# EAGLE schematic PLC.63001-Silo-Medium (EAGLE 9.6.2)

## Sheet 1 of 11: Main Connectors
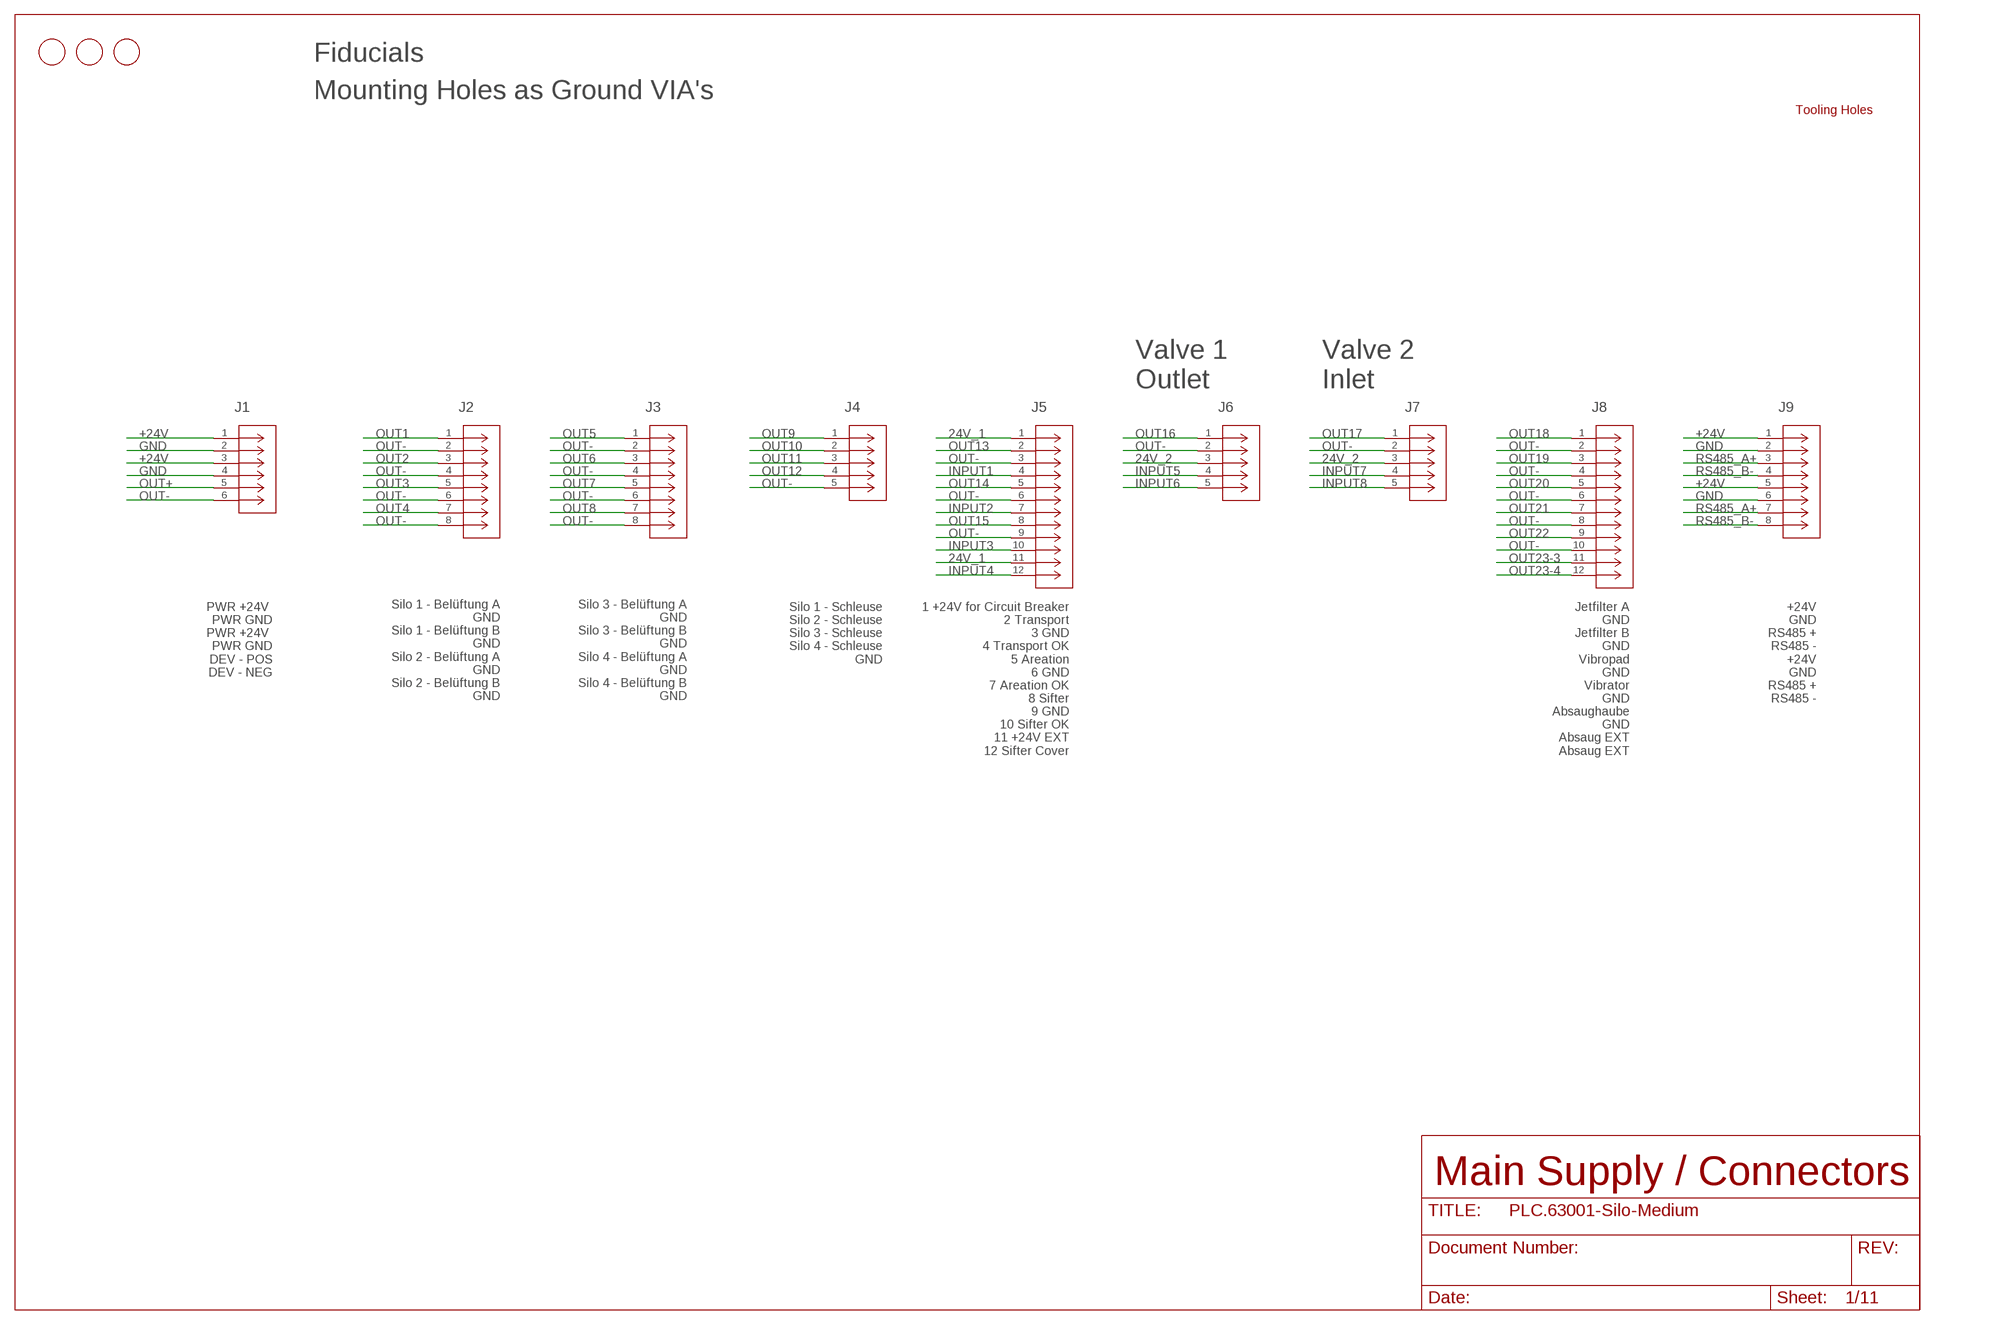
[diagram p0: schematic, sheet 1]

### Parts
J1  OMN_5_06  [CONN6_8000072438_WED]
J2  OMN_5_08  OMN_5_08ROT  [CONN_08_OMN_ROT]
J3  OMN_5_08  OMN_5_08ROT  [CONN_08_OMN_ROT]
J4  OMN_5_05  [CONN_05_OMN]
J5  OMN_5_12  [CONN12_8000072470_WED]
J6  OMN_5_05  OMN_5_05ROT  [CONN_05_OMN_ROT]
J7  OMN_5_05  OMN_5_05ROT  [CONN_05_OMN_ROT]
J8  OMN_5_12  OMN_5_12ROT  [CONN12_8000072470_WED_ROT]
J9  OMN_5_08  [CONN_08_OMN]
N1  _FIDUCIAL  [FIDUCIAL_1MM]
N2  _FIDUCIAL  [FIDUCIAL_1MM]
N3  _FIDUCIAL  [FIDUCIAL_1MM]
U1  BASEBOARD_TOOLING  [_THL_VP]

### Nets
24V_1 [24V]: J5.1 J5.11 ; also sheet 2
24V_2 [24V]: J6.3 J7.3 ; also sheet 2
+24V: J1.1 J1.3 J9.1 J9.5 ; also sheet 2
GND [GND]: J1.2 J1.4 J9.2 J9.6 ; also sheet 2,3,4,5,6,7,8,9,10,11
INPUT1: J5.4 ; also sheet 8
INPUT2: J5.7 ; also sheet 8
INPUT3: J5.10 ; also sheet 8
INPUT4: J5.12 ; also sheet 8
INPUT5: J6.4 ; also sheet 8
INPUT6: J6.5 ; also sheet 8
INPUT7: J7.4 ; also sheet 8
INPUT8: J7.5 ; also sheet 8
OUT1: J2.1 ; also sheet 9
OUT2 [24V]: J2.3 ; also sheet 9
OUT3: J2.5 ; also sheet 9
OUT4: J2.7 ; also sheet 9
OUT5: J3.1 ; also sheet 9
OUT6: J3.3 ; also sheet 9
OUT7: J3.5 ; also sheet 9
OUT8: J3.7 ; also sheet 9
OUT9 [24V]: J4.1 ; also sheet 10
OUT10 [24V]: J4.2 ; also sheet 10
OUT11: J4.3 ; also sheet 10
OUT12: J4.4 ; also sheet 10
OUT13 [24V]: J5.2 ; also sheet 10
OUT14 [24V]: J5.5 ; also sheet 10
OUT15 [24V]: J5.8 ; also sheet 10
OUT16 [24V]: J6.1 ; also sheet 10
OUT17 [24V]: J7.1 ; also sheet 11
OUT18 [24V]: J8.1 ; also sheet 11
OUT19 [24V]: J8.3 ; also sheet 11
OUT20 [24V]: J8.5 ; also sheet 11
OUT21 [24V]: J8.7 ; also sheet 11
OUT22 [24V]: J8.9 ; also sheet 11
OUT23-3 [24V]: J8.11 ; also sheet 11
OUT23-4 [24V]: J8.12 ; also sheet 11
OUT+ [24V]: J1.5 ; also sheet 9,10,11
OUT- [24V]: J1.6 J2.2 J2.4 J2.6 J2.8 J3.2 J3.4 J3.6 J3.8 J4.5 J5.3 J5.6 J5.9 J6.2 J7.2 J8.2 J8.4 J8.6 J8.8 J8.10
RS485_A+: J9.3 J9.7 ; also sheet 6
RS485_B-: J9.4 J9.8 ; also sheet 6

### Notes on the sheet
- Fiducials
- Mounting Holes as Ground VIA's
- Valve 1
  Outlet
- Valve 2
  Inlet
- Silo 1 - Belüftung A
  GND
  Silo 1 - Belüftung B
  GND
  Silo 2 - Belüftung A
  GND
  Silo 2 - Belüftung B
  GND
- Silo 3 - Belüftung A
  GND
  Silo 3 - Belüftung B
  GND
  Silo 4 - Belüftung A
  GND
  Silo 4 - Belüftung B
  GND
- PWR +24V 
  PWR GND
  PWR +24V 
  PWR GND
  DEV - POS
  DEV - NEG
- Silo 1 - Schleuse
  Silo 2 - Schleuse
  Silo 3 - Schleuse
  Silo 4 - Schleuse
  GND
- 1 +24V for Circuit Breaker
  2 Transport
  3 GND
  4 Transport OK
  5 Areation
  6 GND
  7 Areation OK
  8 Sifter
  9 GND
  10 Sifter OK
  11 +24V EXT
  12 Sifter Cover
- Jetfilter A
  GND
  Jetfilter B
  GND
  Vibropad
  GND
  Vibrator
  GND
  Absaughaube
  GND
  Absaug EXT
  Absaug EXT
- +24V
  GND
  RS485 +
  RS485 -
  +24V
  GND
  RS485 +
  RS485 -
- Main Supply / Connectors

## Sheet 2 of 11: Power Supply
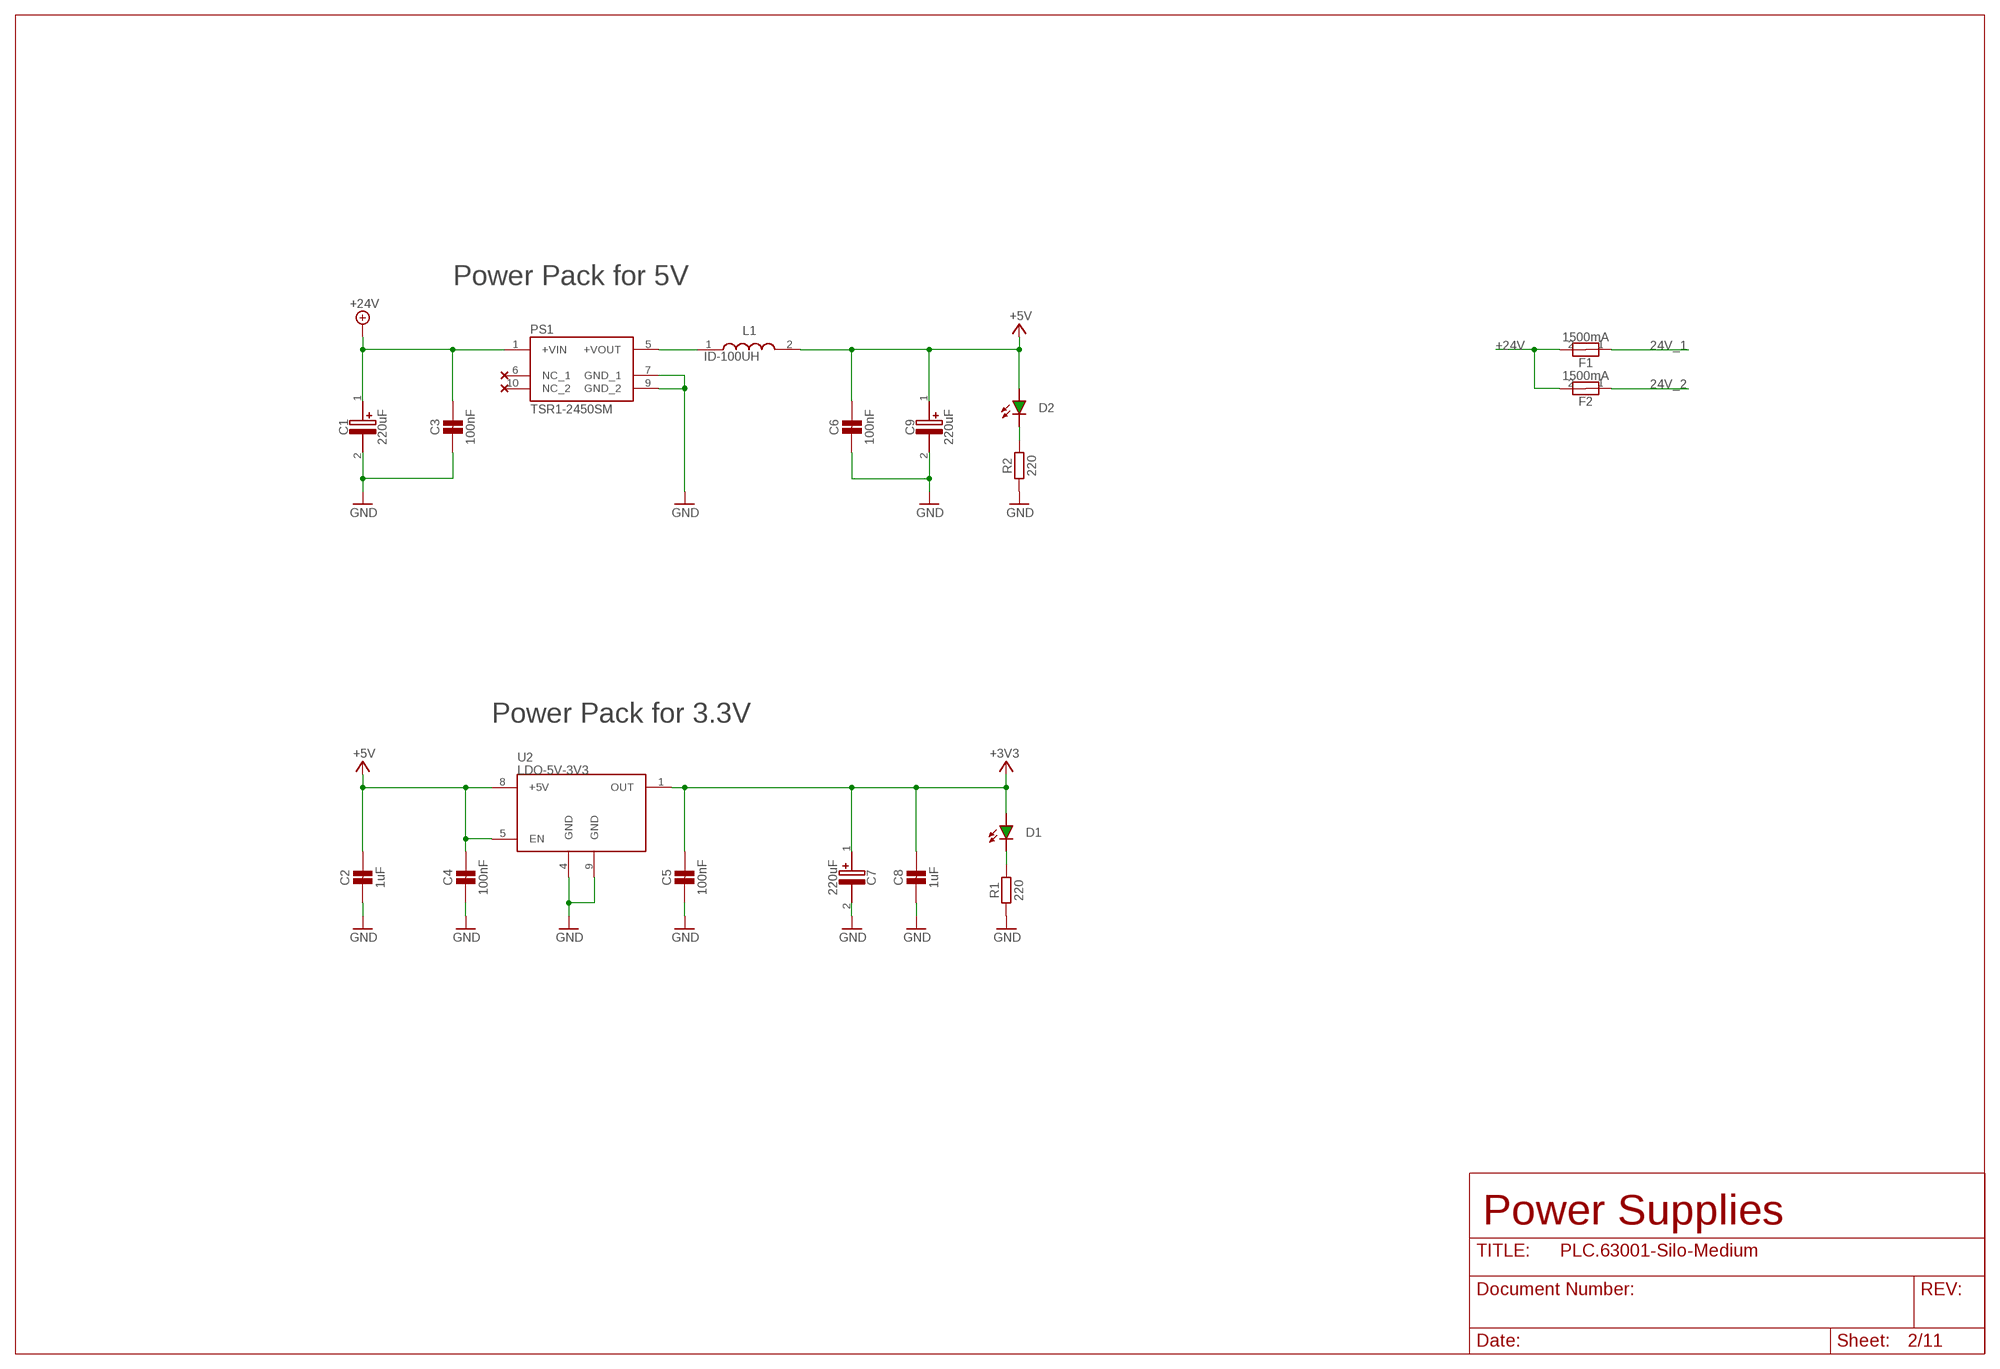
[diagram p1: schematic, sheet 2]

### Parts
C1  C-220U-10X10  [CAPAE1030X1050N]
C2  C-1U-0805  [C0805]
C3  C-100N-0805  [C0805]
C4  C-100N-0805  [C0805]
C5  C-100N-0805  [C0805]
C6  C-100N-0805  [C0805]
C7  C-220U-10X10  [CAPAE1030X1050N]
C8  C-1U-0805  [C0805]
C9  C-220U-10X10  [CAPAE1030X1050N]
D1  LED-GREEN-0805  [L0805]
D2  LED-GREEN-0805  [L0805]
F1  F-1500MA  [FUSC4632X75N]
F2  F-1500MA  [FUSC4632X75N]
L1  ID-100UH  [INDPM120120X100N]
PS1  TSR1-2450SM  [TSR124120SM]
R1  R-220-0805  [R0805]
R2  R-220-0805  [R0805]
U2  LDO-5V-3V3  [NCV8165ML330TBG]
X24  _NC_MARKER  (no package)
X25  _NC_MARKER  (no package)

### Nets
24V_1 [24V]: F1.1 ; also sheet 1
24V_2 [24V]: F2.1 ; also sheet 1
+3V3: C5.1 C7.1(+) C8.1 D1.A U2.1(OUT) ; also sheet 3,4,5,6,7,8,9,10,11
+5V: C2.1 C4.1 C6.1 C9.1(+) D2.A L1.2 U2.5(EN) U2.8(+5V) ; also sheet 9,10,11
+24V: C1.1(+) C3.1 F1.2 F2.2 PS1.1(+VIN) ; also sheet 1
GND [GND]: C1.2(-) C2.2 C3.2 C4.2 C5.2 C6.2 C7.2(-) C8.2 C9.2(-) PS1.7(GND_1) PS1.9(GND_2) R1.1 R2.1 U2.4(GND) U2.9(GND) ; also sheet 1,3,4,5,6,7,8,9,10,11
N$10: D2.C R2.2
N$45: D1.C R1.2
N$55: PS1.10(NC_2) X24.P$1
N$56: PS1.6(NC_1) X25.P$1
N$76: L1.1 PS1.5(+VOUT)
Unconnected: U2.2(NC1) U2.3(NC2) U2.6(NC3) U2.7(NC4)

### Notes on the sheet
- Power Pack for 5V
- Power Pack for 3.3V
- Power Supplies

## Sheet 3 of 11: MCU Host CPU
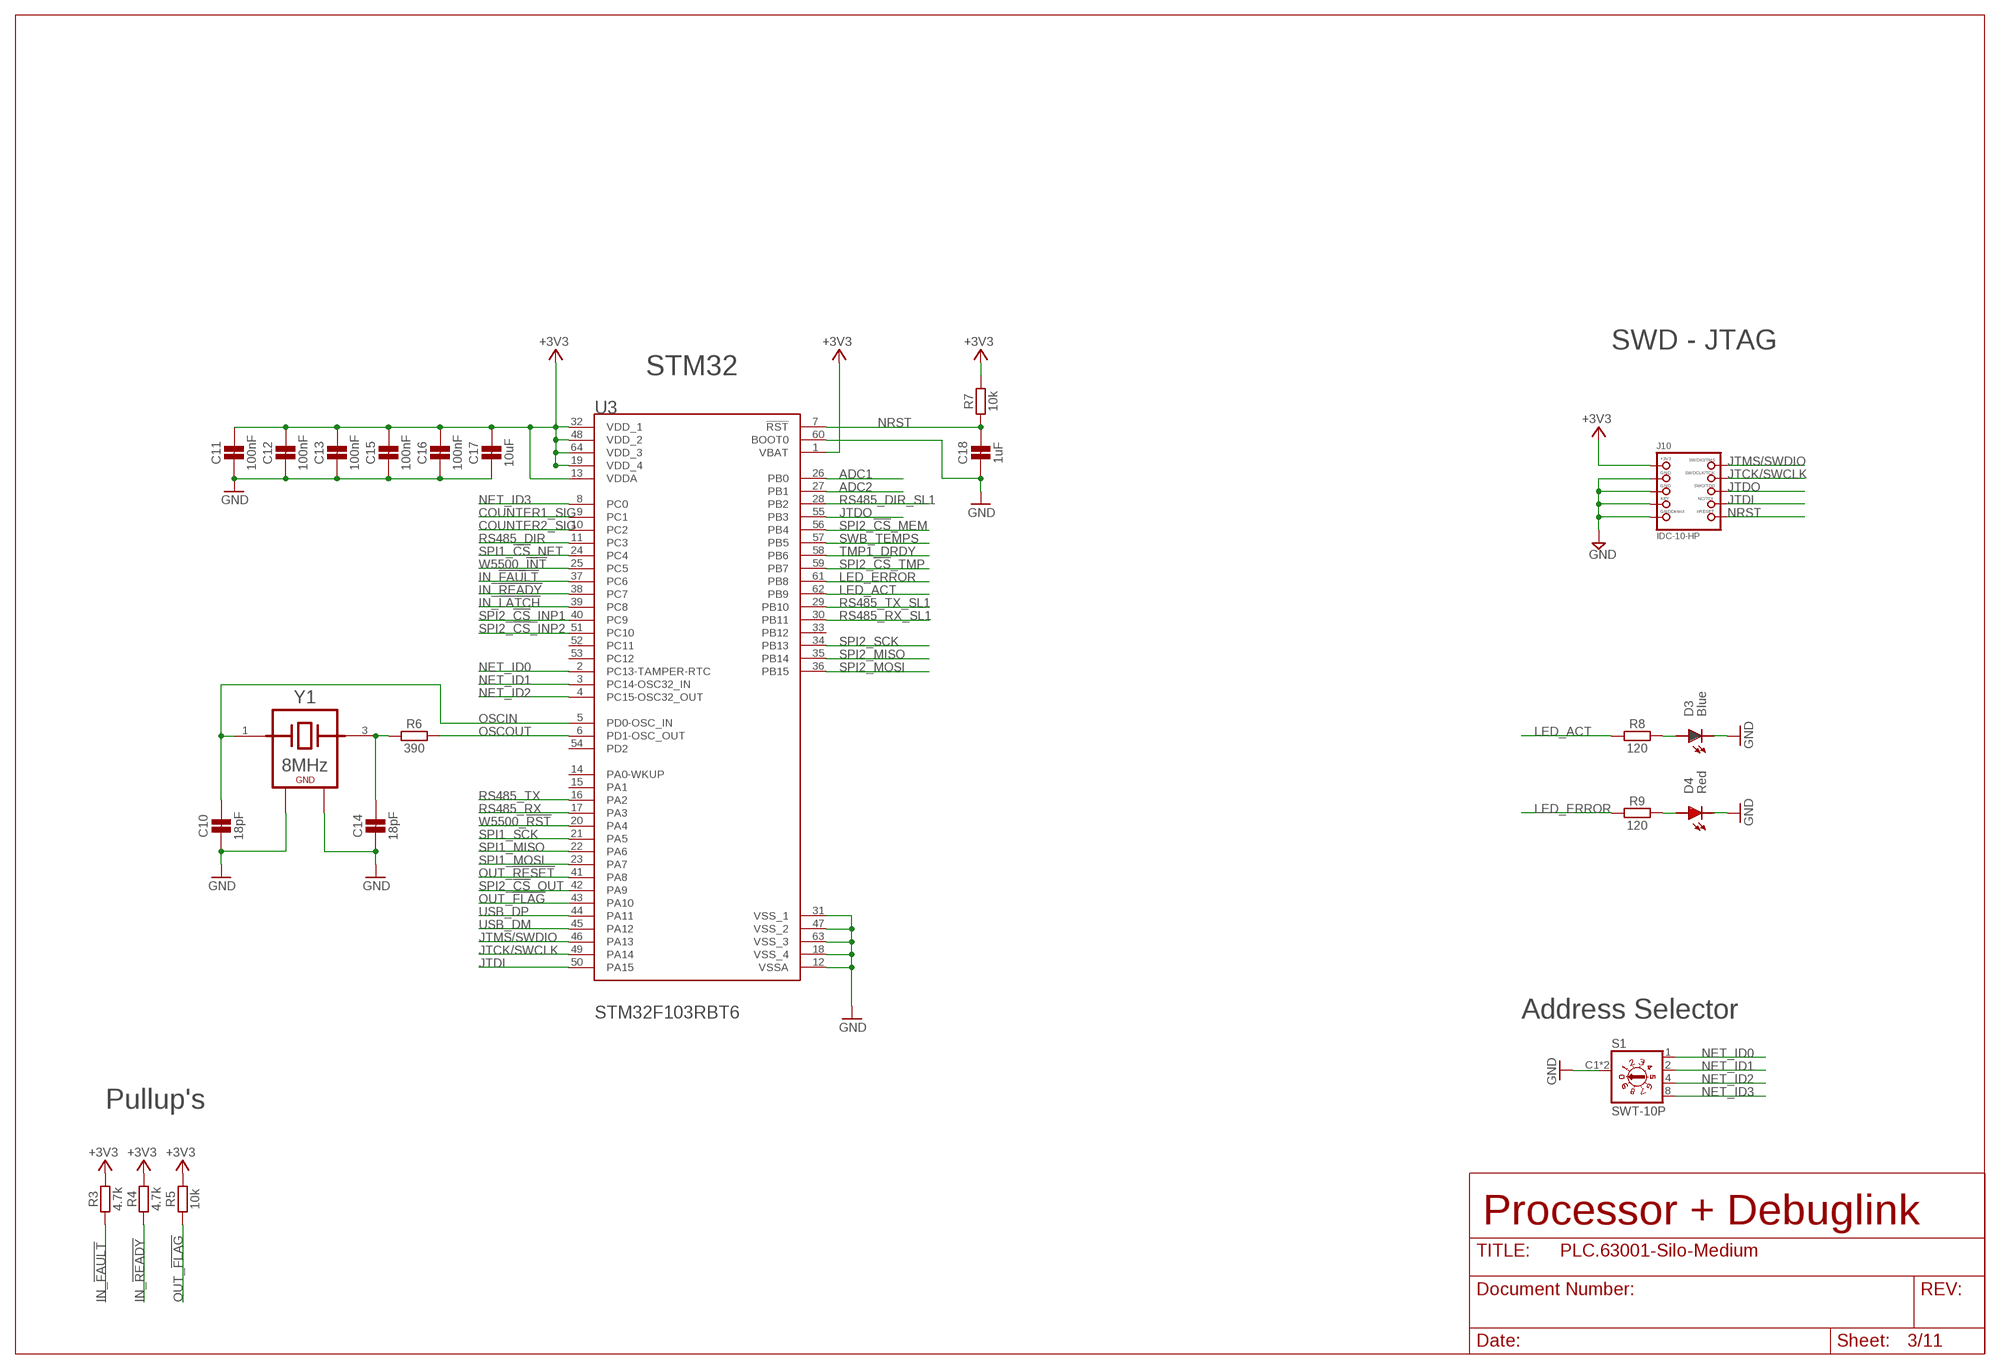
[diagram p2: schematic, sheet 3]

### Parts
C10  C-18P-0805  [C0805]
C11  C-100N-0805  [C0805]
C12  C-100N-0805  [C0805]
C13  C-100N-0805  [C0805]
C14  C-18P-0805  [C0805]
C15  C-100N-0805  [C0805]
C16  C-100N-0805  [C0805]
C17  C-10U-0805  [C0805]
C18  C-1U-0805  [C0805]
D3  LED-BLUE-0805  [L0805]
D4  LED-RED-0805  [L0805]
J10  IDC-10-HP  SWD-CON-10BOX  [2X05_1.27MM_BOX_NOPOSTS]
R3  R-4K7-0805  [R0805]
R4  R-4K7-0805  [R0805]
R5  R-10K-0805  [R0805]
R6  R-390-0805  [R0805]
R7  R-10K-0805  [R0805]
R8  R-120-0805  [R0805]
R9  R-120-0805  [R0805]
S1  SWT-10P  [42854232081X_10POS]
U3  STM32F103RB  [ST_MICROELECTRONICS_STM32F103RBT6_0]
Y1  QRZ-8MHZ  [4-SMD3.2X2.5MM,NOLEAD]

### Nets
+3V3: C11.1 C12.1 C13.1 C15.1 C16.1 C17.1 J10.1(+3V3) R3.2 R4.2 R5.2 R7.2 U3.1(VBAT) U3.13(VDDA) U3.19(VDD_4) U3.32(VDD_1) U3.48(VDD_2) U3.64(VDD_3) ; also sheet 2,4,5,6,7,8,9,10,11
ADC1: U3.26(PB0)
ADC2: U3.27(PB1)
COUNTER1_SIG: U3.9(PC1)
COUNTER2_SIG: U3.10(PC2)
GND [GND]: C10.2 C11.2 C12.2 C13.2 C14.2 C15.2 C16.2 C17.2 C18.2 D3.C D4.C J10.3(GND) J10.5(GND) J10.7(KEY) J10.9(GNDDETECT) S1.C1(C) S1.C2(C) U3.12(VSSA) U3.18(VSS_4) U3.31(VSS_1) U3.47(VSS_2) U3.60(BOOT0) U3.63(VSS_3) Y1.2(1_GND) Y1.4(2_GND) ; also sheet 1,2,4,5,6,7,8,9,10,11
IN_!FAULT!: R3.1 U3.37(PC6) ; also sheet 8
IN_!LATCH!: U3.39(PC8) ; also sheet 8
IN_!READY!: R4.1 U3.38(PC7) ; also sheet 8
JTCK/SWCLK: J10.4(SWDCLK) U3.49(PA14)
JTDI: J10.8(TDI) U3.50(PA15)
JTDO: J10.6(SWO) U3.55(PB3)
JTMS/SWDIO: J10.2(SWDIO) U3.46(PA13)
LED_ACT: R8.1 U3.62(PB9)
LED_ERROR: R9.1 U3.61(PB8)
N$33: C14.1 R6.1 Y1.3
N$97: D3.A R8.2
N$98: D4.A R9.2
NET_ID0: S1.1 U3.2(PC13-TAMPER-RTC)
NET_ID1: S1.2 U3.3(PC14-OSC32_IN)
NET_ID2: S1.4 U3.4(PC15-OSC32_OUT)
NET_ID3: S1.8 U3.8(PC0)
NRST: C18.1 J10.10(NRESET) R7.1 U3.7(!RST!)
OSCIN: C10.1 U3.5(PD0-OSC_IN) Y1.1
OSCOUT: R6.2 U3.6(PD1-OSC_OUT)
OUT_!FLAG!: R5.1 U3.43(PA10) ; also sheet 9,10,11
OUT_!RESET!: U3.41(PA8) ; also sheet 9,10,11
RS485_DIR: U3.11(PC3) ; also sheet 6
RS485_DIR_SL1: U3.28(PB2)
RS485_RX: U3.17(PA3) ; also sheet 6
RS485_RX_SL1: U3.30(PB11)
RS485_TX: U3.16(PA2) ; also sheet 6
RS485_TX_SL1: U3.29(PB10)
SPI1_!CS!_NET: U3.24(PC4) ; also sheet 5
SPI1_MISO: U3.22(PA6) ; also sheet 5
SPI1_MOSI: U3.23(PA7) ; also sheet 5
SPI1_SCK: U3.21(PA5) ; also sheet 5
SPI2_!CS!_INP1: U3.40(PC9) ; also sheet 8
SPI2_!CS!_INP2: U3.51(PC10)
SPI2_!CS!_MEM: U3.56(PB4) ; also sheet 4
SPI2_!CS!_OUT: U3.42(PA9) ; also sheet 9,10,11
SPI2_!CS!_TMP: U3.59(PB7)
SPI2_MISO: U3.35(PB14) ; also sheet 4,8,11
SPI2_MOSI: U3.36(PB15) ; also sheet 4,8,9
SPI2_SCK: U3.34(PB13) ; also sheet 4,8,9,10,11
SWB_TEMPS: U3.57(PB5) ; also sheet 7
TMP1_DRDY: U3.58(PB6)
USB_DM: U3.45(PA12)
USB_DP: U3.44(PA11)
W5500_!INT!: U3.25(PC5) ; also sheet 5
W5500_!RST!: U3.20(PA4) ; also sheet 5
Unconnected: U3.14(PA0-WKUP) U3.15(PA1) U3.33(PB12) U3.52(PC11) U3.53(PC12) U3.54(PD2)

### Notes on the sheet
- SWD - JTAG
- STM32
- Address Selector
- Pullup's
- Processor + Debuglink

## Sheet 4 of 11
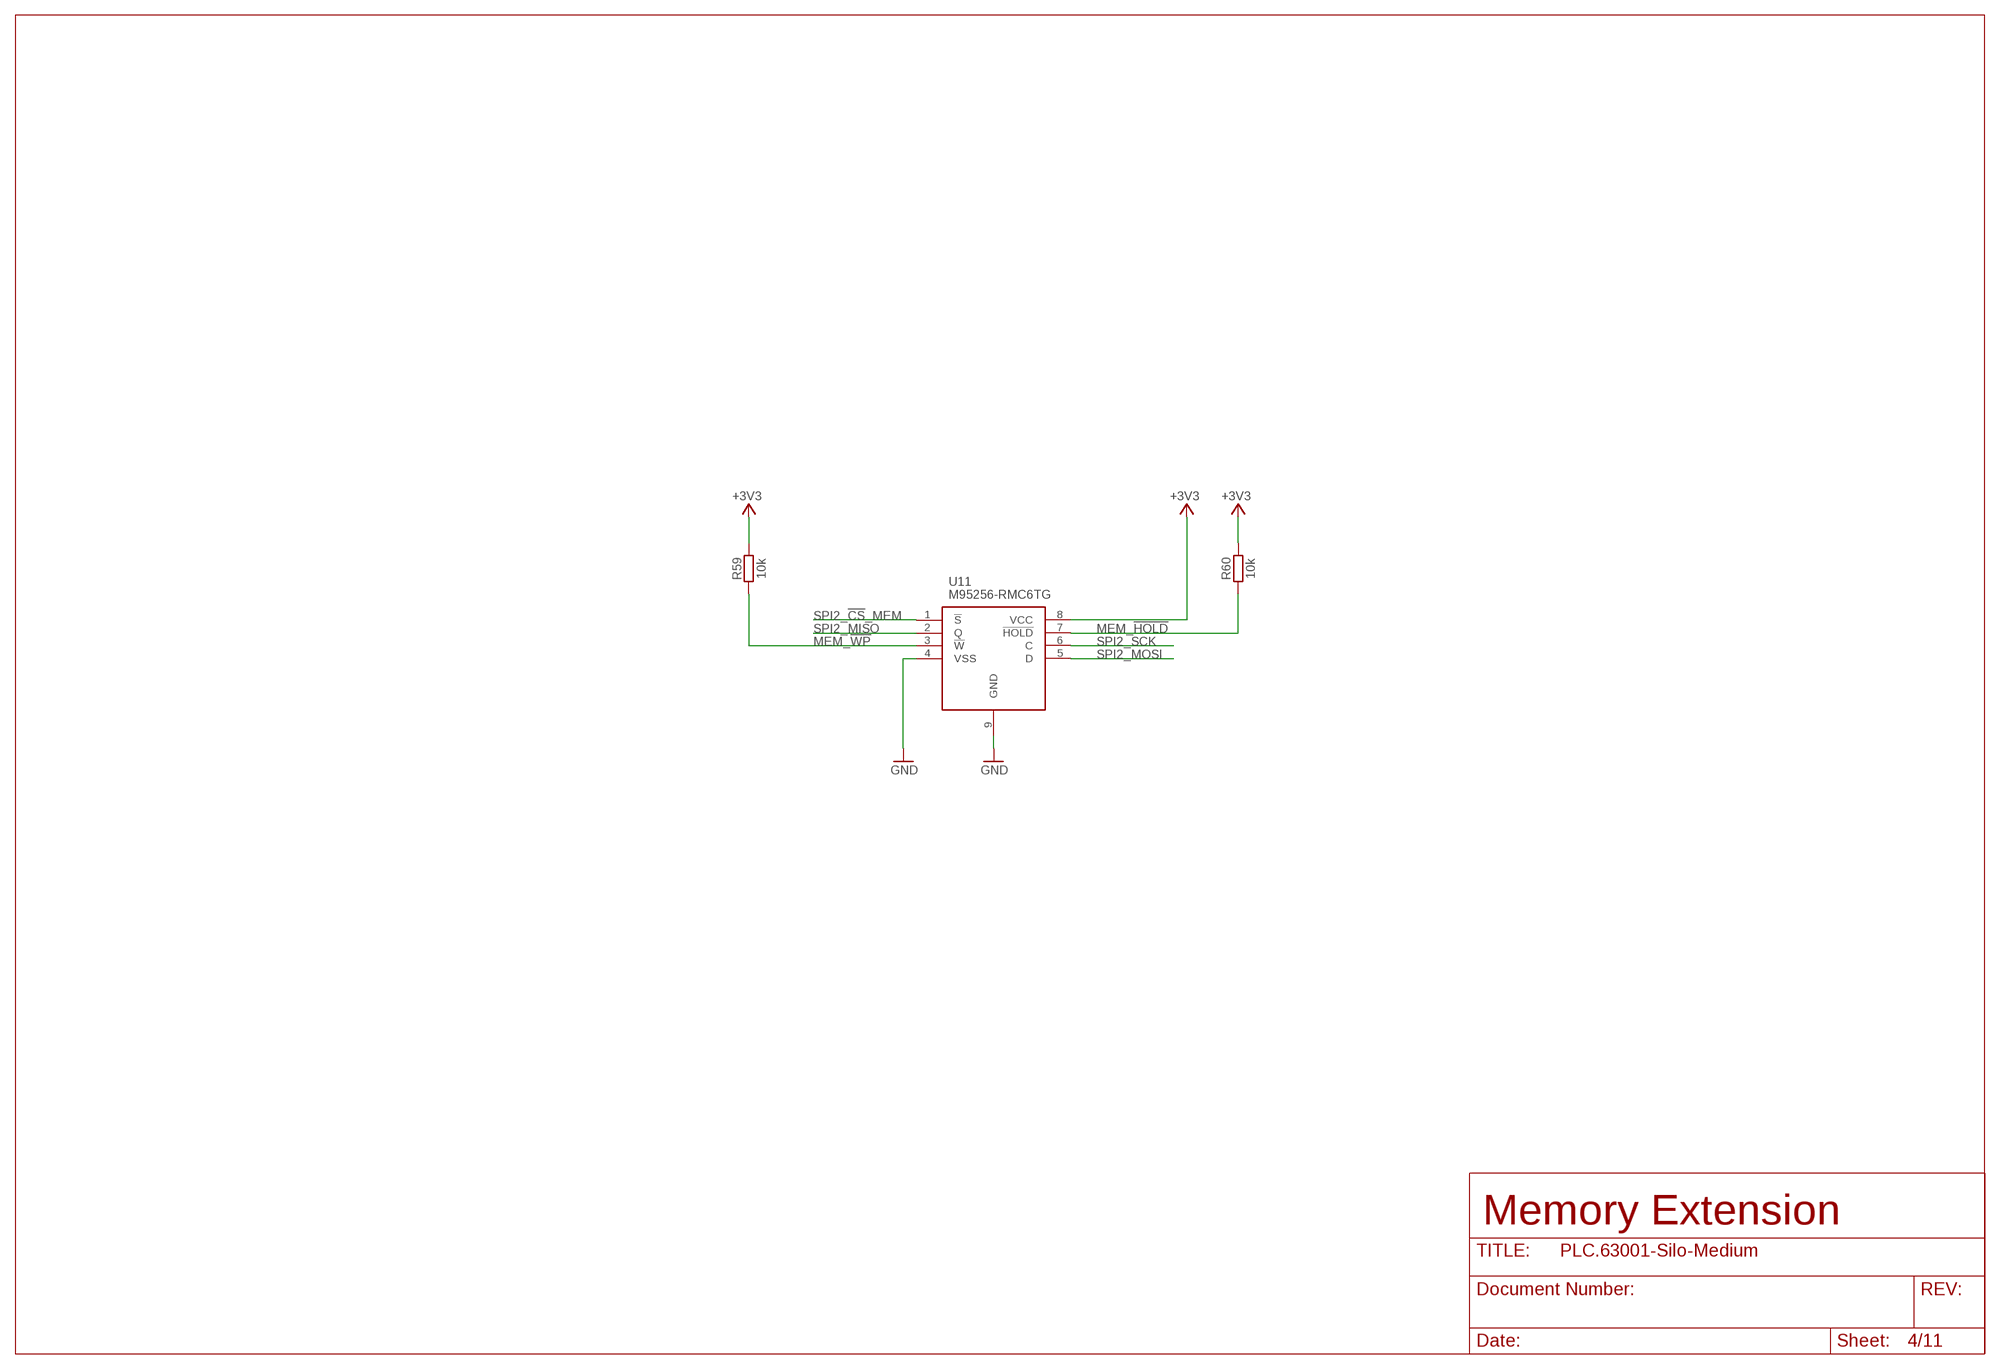
[diagram p3: schematic, sheet 4]

### Parts
R59  R-10K-0805  [R0805]
R60  R-10K-0805  [R0805]
U11  M95256-RMC6TG  [SON50P300X200X60-9N]

### Nets
+3V3: R59.2 R60.2 U11.8(VCC) ; also sheet 2,3,5,6,7,8,9,10,11
GND [GND]: U11.4(VSS) U11.9(GND) ; also sheet 1,2,3,5,6,7,8,9,10,11
MEM_!HOLD: R60.1 U11.7(!HOLD)
MEM_!WP: R59.1 U11.3(!W)
SPI2_!CS!_MEM: U11.1(!S) ; also sheet 3
SPI2_MISO: U11.2(Q) ; also sheet 3,8,11
SPI2_MOSI: U11.5(D) ; also sheet 3,8,9
SPI2_SCK: U11.6(C) ; also sheet 3,8,9,10,11

### Notes on the sheet
- Memory Extension

## Sheet 5 of 11: Network
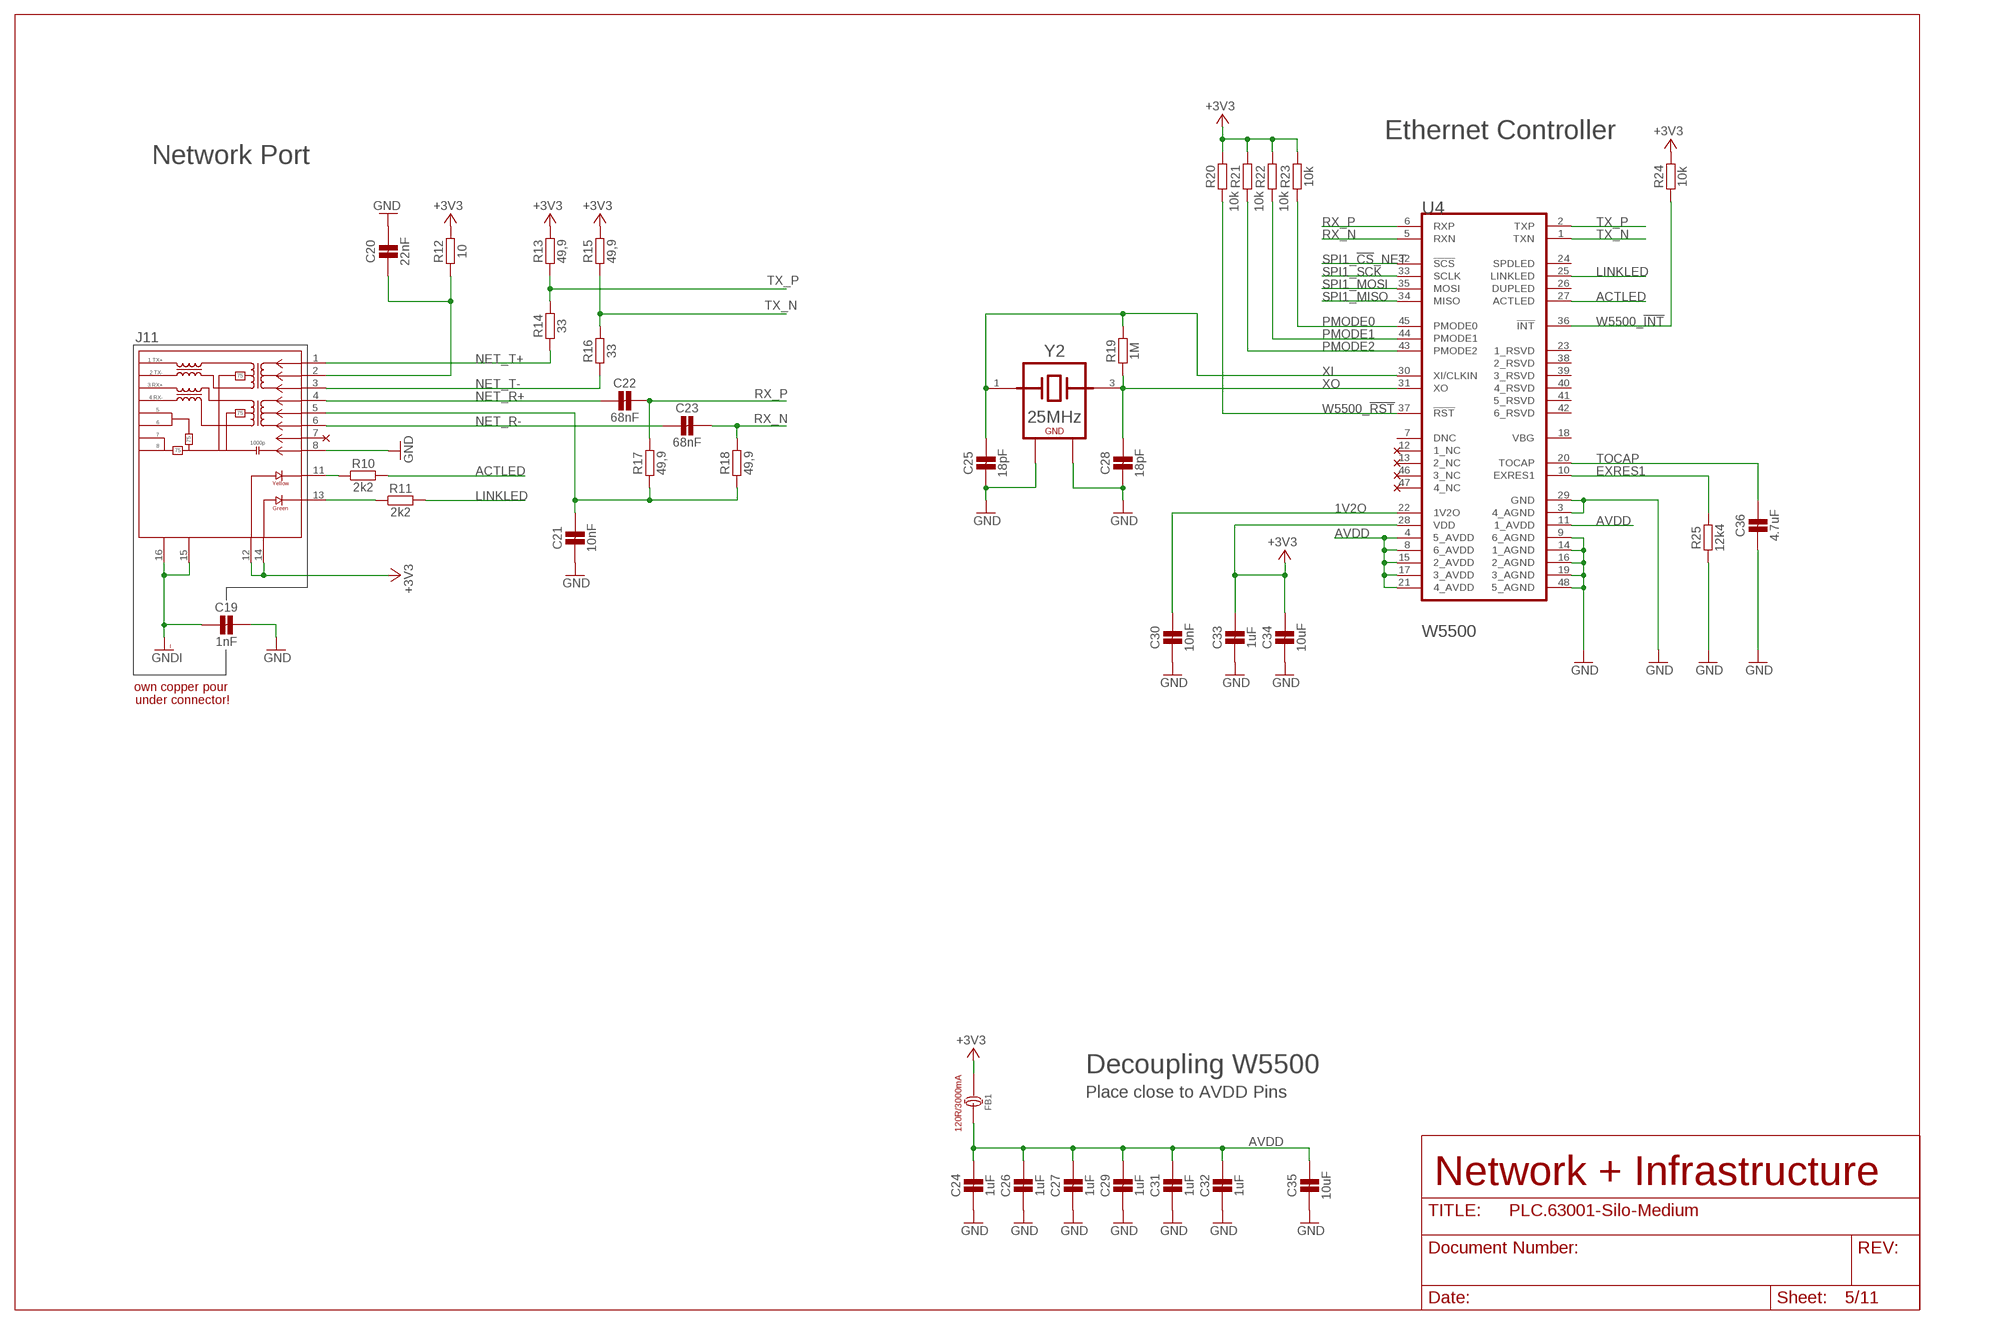
[diagram p4: schematic, sheet 5]

### Parts
C19  C-1N-1812  [C1812]
C20  C-22N-0805  [C0805]
C21  C-10N-0805  [C0805]
C22  C-68N-0805  [C0805]
C23  C-68N-0805  [C0805]
C24  C-1U-0805  [C0805]
C25  C-18P-0805  [C0805]
C26  C-1U-0805  [C0805]
C27  C-1U-0805  [C0805]
C28  C-18P-0805  [C0805]
C29  C-1U-0805  [C0805]
C30  C-10N-0805  [C0805]
C31  C-1U-0805  [C0805]
C32  C-1U-0805  [C0805]
C33  C-1U-0805  [C0805]
C34  C-10U-0805  [C0805]
C35  C-10U-0805  [C0805]
C36  C-4U7-0805  [C0805]
FB1  FB-120R  [HANDHELDMAINBOARD2_0805L]
J11  NET-MAG-LED_THR_180  [CONN14_2562150000_WED]
R10  R-2K2-0805  [R0805]
R11  R-2K2-0805  [R0805]
R12  R-10-0805  [R0805]
R13  R-49R9-0805  [R0805]
R14  R-33-0805  [R0805]
R15  R-49R9-0805  [R0805]
R16  R-33-0805  [R0805]
R17  R-49R9-0805  [R0805]
R18  R-49R9-0805  [R0805]
R19  R-1M-0805  [R0805]
R20  R-10K-0805  [R0805]
R21  R-10K-0805  [R0805]
R22  R-10K-0805  [R0805]
R23  R-10K-0805  [R0805]
R24  R-10K-0805  [R0805]
R25  R-12K4-0805  [R0805]
U4  W5500  [WIZNET_W5500_0]
X19  _NC_MARKER  (no package)
X20  _NC_MARKER  (no package)
X21  _NC_MARKER  (no package)
X22  _NC_MARKER  (no package)
X23  _NC_MARKER  (no package)
Y2  QRZ-25MHZ  [ECS2501836B2CTYTR]

### Nets
1V2O: C30.1 U4.22(1V2O)
+3V3: C33.1 C34.1 FB1.2 J11.12 J11.14 R12.2 R13.2 R15.2 R20.2 R21.2 R22.2 R23.2 R24.2 U4.28(VDD) ; also sheet 2,3,4,6,7,8,9,10,11
ACTLED: R10.2 U4.27(ACTLED)
AVDD: C24.1 C26.1 C27.1 C29.1 C31.1 C32.1 C35.1 FB1.1 U4.4(5_AVDD) U4.8(6_AVDD) U4.11(1_AVDD) U4.15(2_AVDD) U4.17(3_AVDD) U4.21(4_AVDD)
EXRES1: R25.2 U4.10(EXRES1)
GND [GND]: C19.1 C20.1 C21.2 C24.2 C25.2 C26.2 C27.2 C28.2 C29.2 C30.2 C31.2 C32.2 C33.2 C34.2 C35.2 C36.2 J11.8 R25.1 U4.3(4_AGND) U4.9(6_AGND) U4.14(1_AGND) U4.16(2_AGND) U4.19(3_AGND) U4.29(GND) U4.48(5_AGND) Y2.2(1_GND) Y2.4(2_GND) ; also sheet 1,2,3,4,6,7,8,9,10,11
GNDI: C19.2 J11.15 J11.16
LINKLED: R11.2 U4.25(LINKLED)
N$61: C21.1 J11.5 R17.1 R18.1
N$64: J11.7 X19.P$1
N$65: U4.47(4_NC) X20.P$1
N$66: U4.46(3_NC) X21.P$1
N$67: U4.13(2_NC) X22.P$1
N$68: U4.12(1_NC) X23.P$1
N$70: J11.11 R10.1
N$71: J11.13 R11.1
NET_G4: C20.2 J11.2 R12.1
NET_R+: C22.2 J11.4
NET_R-: C23.2 J11.6
NET_T+: J11.1 R14.1
NET_T-: J11.3 R16.1
PMODE0: R23.1 U4.45(PMODE0)
PMODE1: R22.1 U4.44(PMODE1)
PMODE2: R21.1 U4.43(PMODE2)
RX_N: C23.1 R18.2 U4.5(RXN)
RX_P: C22.1 R17.2 U4.6(RXP)
SPI1_!CS!_NET: U4.32(!SCS!) ; also sheet 3
SPI1_MISO: U4.34(MISO) ; also sheet 3
SPI1_MOSI: U4.35(MOSI) ; also sheet 3
SPI1_SCK: U4.33(SCLK) ; also sheet 3
TOCAP: C36.1 U4.20(TOCAP)
TX_N: R15.1 R16.2 U4.1(TXN)
TX_P: R13.1 R14.2 U4.2(TXP)
W5500_!INT!: R24.1 U4.36(!INT!) ; also sheet 3
W5500_!RST!: R20.1 U4.37(!RST!) ; also sheet 3
XI: C25.1 R19.2 U4.30(XI/CLKIN) Y2.1
XO: C28.1 R19.1 U4.31(XO) Y2.3
Unconnected: U4.7(DNC) U4.18(VBG) U4.23(1_RSVD) U4.24(SPDLED) U4.26(DUPLED) U4.38(2_RSVD) U4.39(3_RSVD) U4.40(4_RSVD) U4.41(5_RSVD) U4.42(6_RSVD)

### Notes on the sheet
- Ethernet Controller
- Network Port
- own copper pour 
  under connector!
- Decoupling W5500
- Place close to AVDD Pins
- Network + Infrastructure

## Sheet 6 of 11: RS485 - Communication
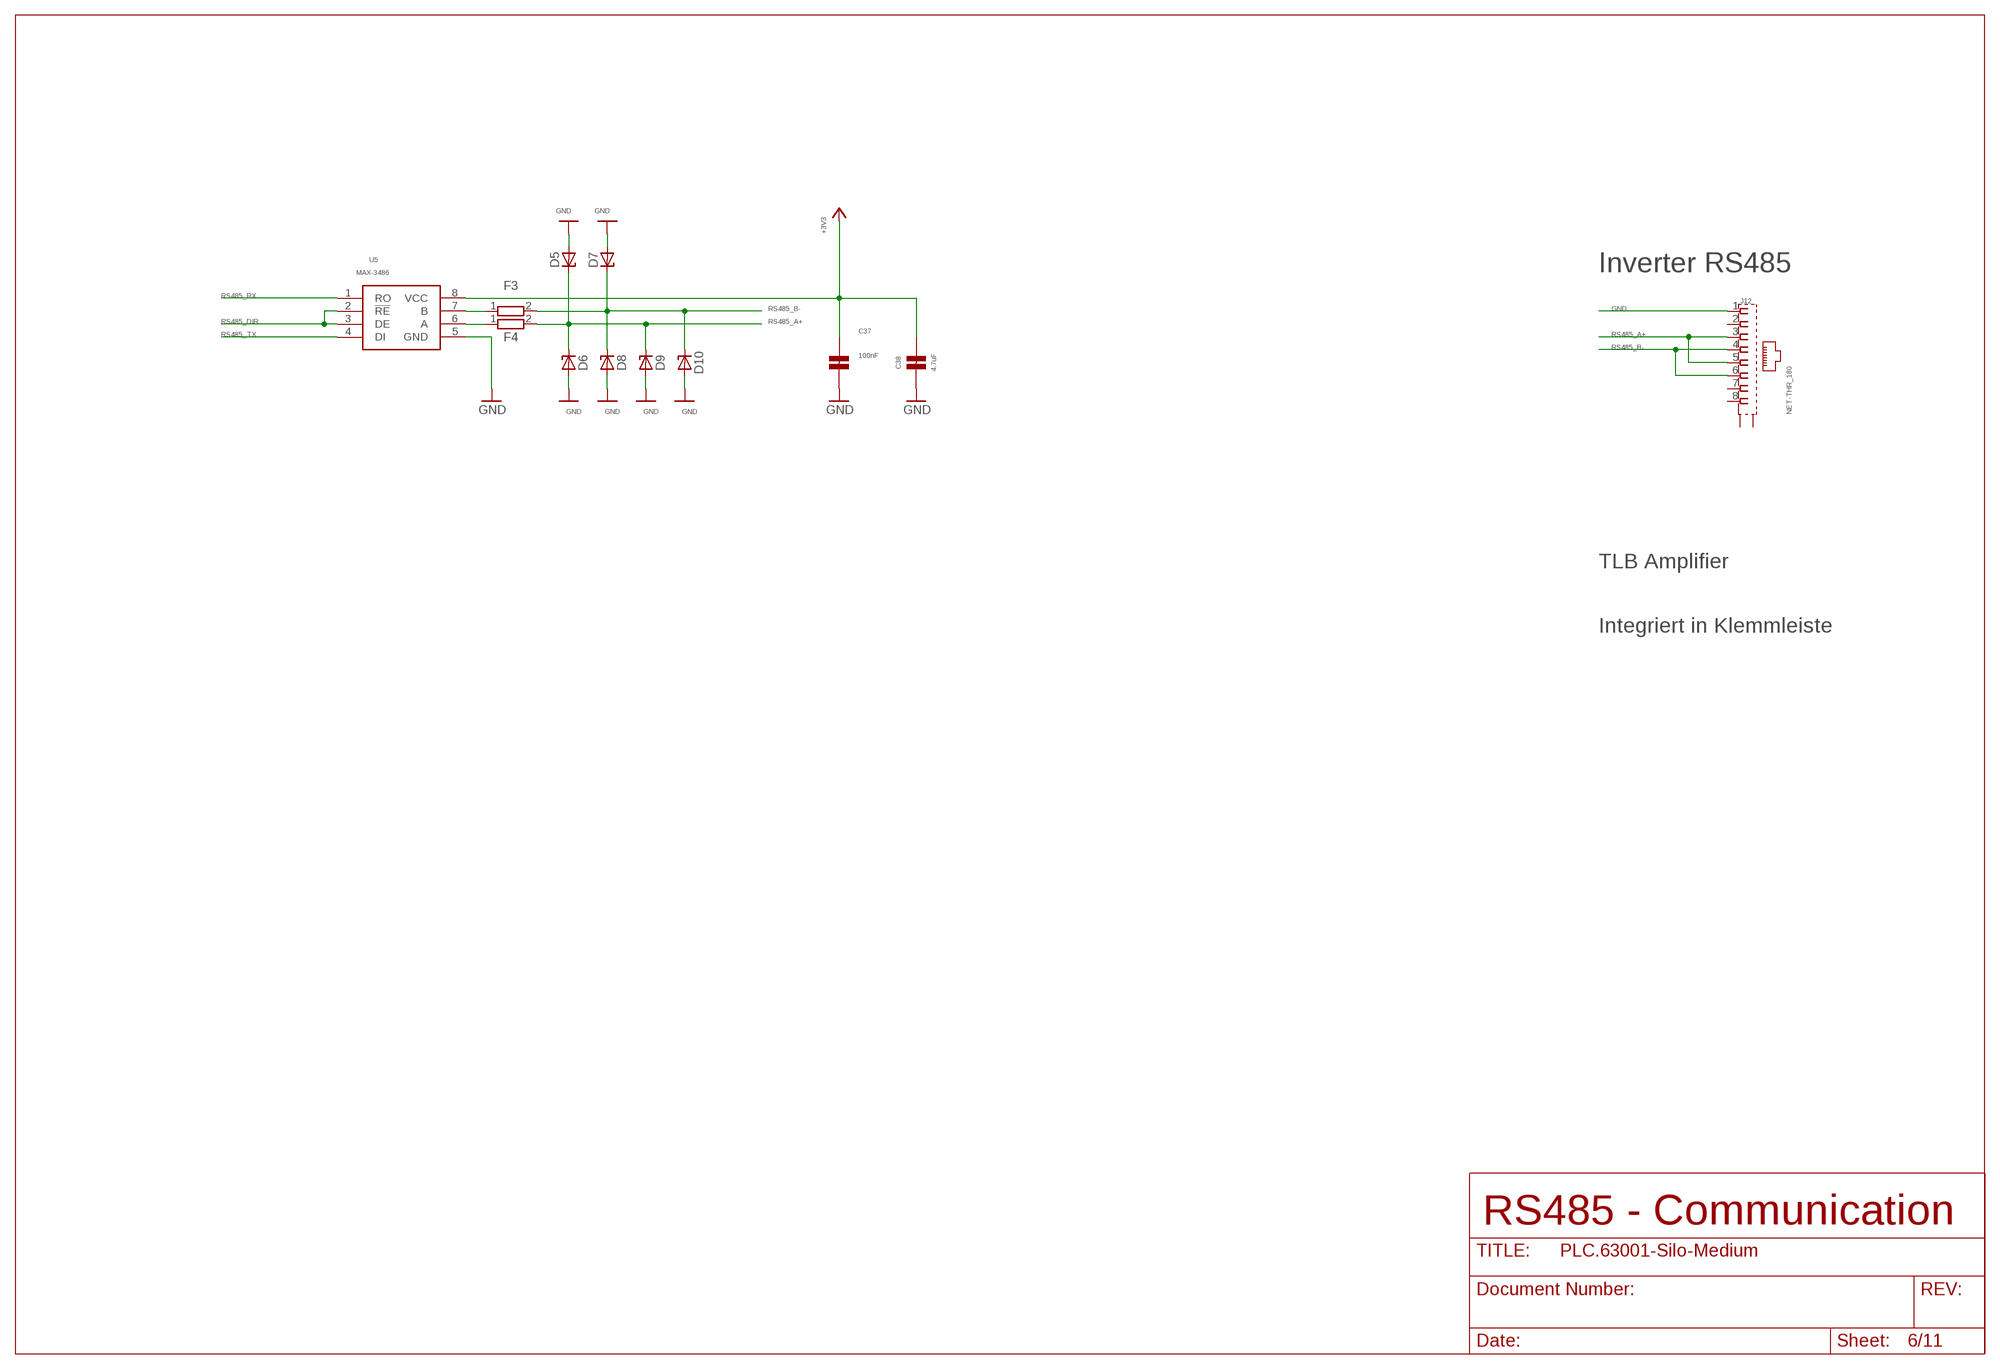
[diagram p5: schematic, sheet 6]

### Parts
C37  C-100N-0805  [C0805]
C38  C-4U7-0805  [C0805]
D5  SMAJ30CA  [DO214AC]
D6  SMAJ30CA  [DO214AC]
D7  SMAJ30CA  [DO214AC]
D8  SMAJ30CA  [DO214AC]
D9  SMAJ30CA  [DO214AC]
D10  SMAJ30CA  [DO214AC]
F3  PTC  04401.25WR  [FUSC3216X86N]
F4  PTC  04401.25WR  [FUSC3216X86N]
J12  NET-THR_180  [CONN8_2562970000_WED]
U5  MAX-3486  [SOIC127P600X175-8N]

### Nets
+3V3: C37.1 C38.1 U5.8(VCC) ; also sheet 2,3,4,5,7,8,9,10,11
GND [GND]: C37.2 C38.2 D5.A D6.A D7.A D8.A D9.A D10.A J12.1 U5.5(GND) ; also sheet 1,2,3,4,5,7,8,9,10,11
N$2: F3.1 U5.7(B)
N$19: F4.1 U5.6(A)
RS485_A+: D5.C D6.C D9.C F4.2 J12.3 J12.5 ; also sheet 1
RS485_B-: D7.C D8.C D10.C F3.2 J12.4 J12.6 ; also sheet 1
RS485_DIR: U5.2(!RE) U5.3(DE) ; also sheet 3
RS485_RX: U5.1(RO) ; also sheet 3
RS485_TX: U5.4(DI) ; also sheet 3
Unconnected: J12.2 J12.7 J12.8 J12.12(S) J12.13(S)

### Notes on the sheet
- Inverter RS485
- TLB Amplifier
- Integriert in Klemmleiste
- RS485 - Communication

## Sheet 7 of 11: Board Temperature Probe
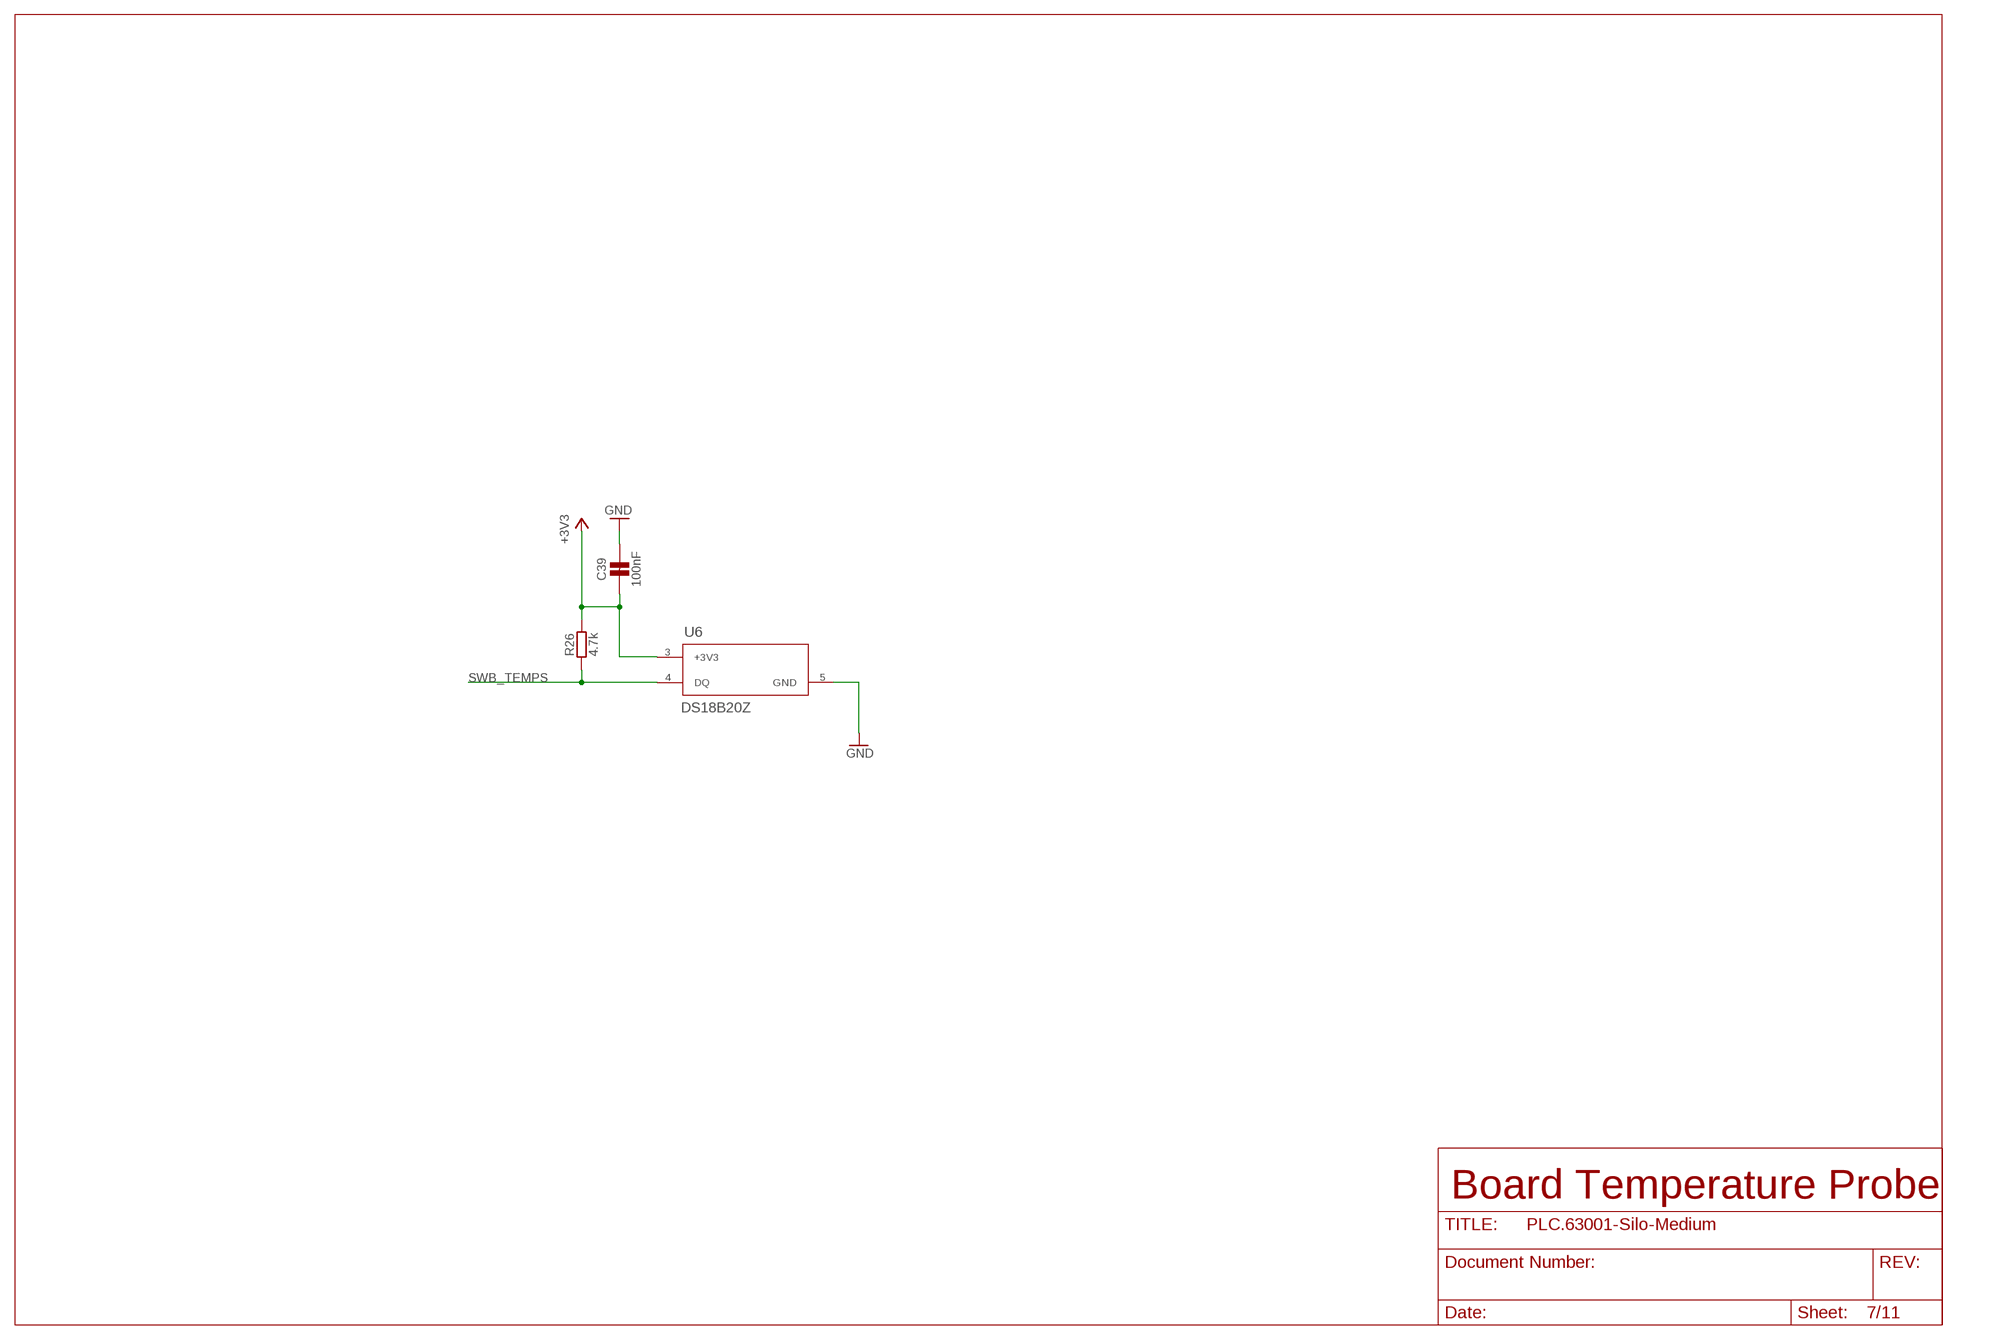
[diagram p6: schematic, sheet 7]

### Parts
C39  C-100N-0805  [C0805]
R26  R-4K7-0805  [R0805]
U6  DS18B20Z  [21-0041B_8_MXM]

### Nets
+3V3: C39.2 R26.2 U6.3(+3V3) ; also sheet 2,3,4,5,6,8,9,10,11
GND [GND]: C39.1 U6.5(GND) ; also sheet 1,2,3,4,5,6,8,9,10,11
SWB_TEMPS: R26.1 U6.4(DQ) ; also sheet 3
Unconnected: U6.1(NC_2) U6.2(NC_3) U6.6(NC_4) U6.7(NC_5) U6.8(NC_1)

### Notes on the sheet
- Board Temperature Probe

## Sheet 8 of 11: Digital Inputs 1 - 8
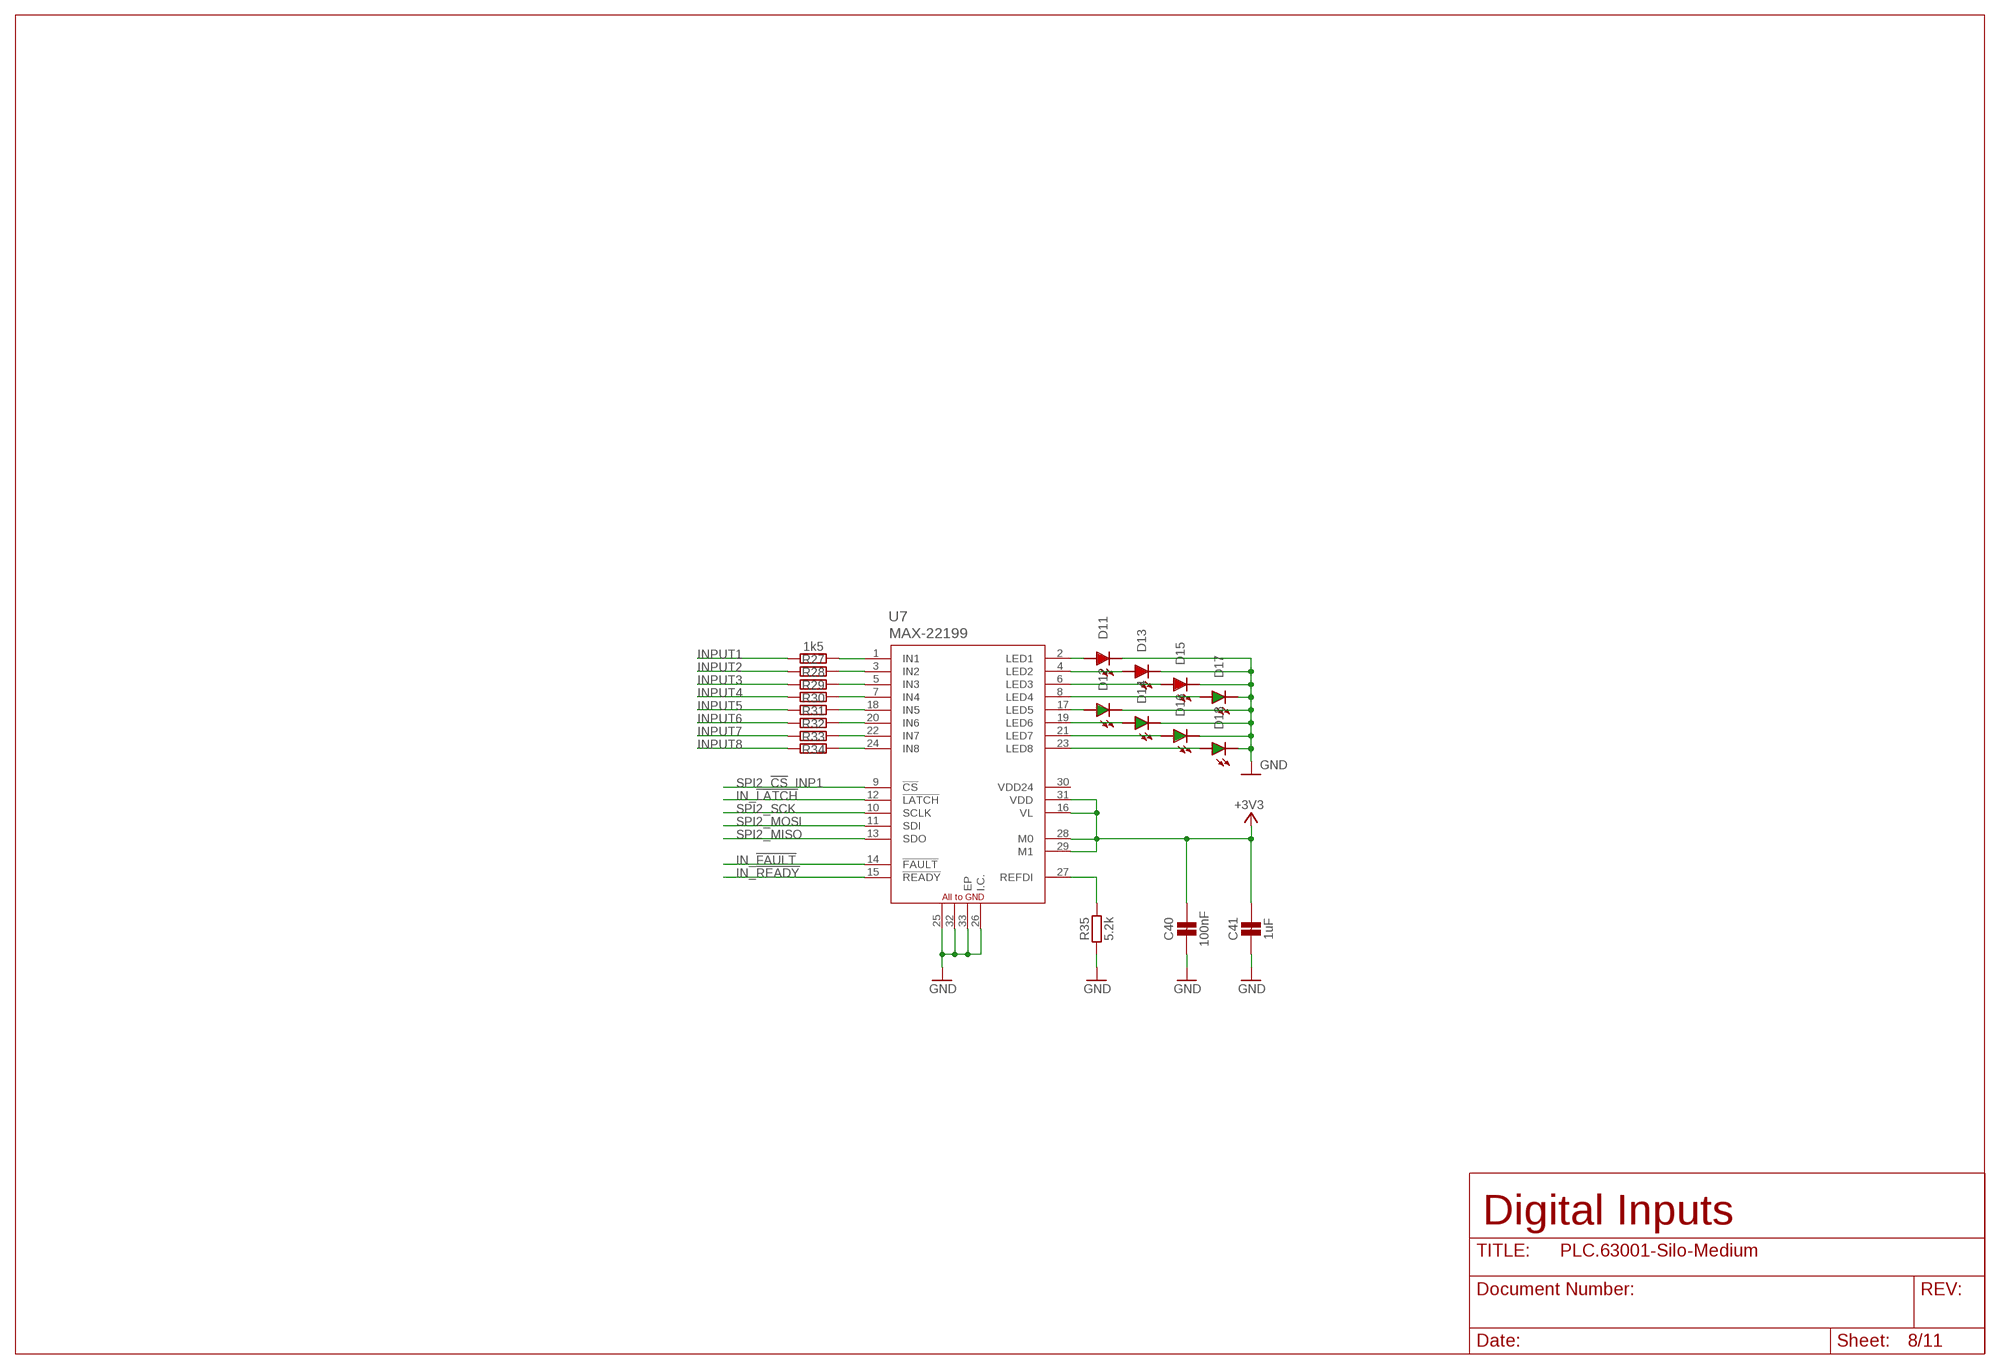
[diagram p7: schematic, sheet 8]

### Parts
C40  C-100N-0805  [C0805]
C41  C-1U-0805  [C0805]
D11  LED-RED-0805  [L0805]
D12  LED-GREEN-0805  [L0805]
D13  LED-RED-0805  [L0805]
D14  LED-GREEN-0805  [L0805]
D15  LED-RED-0805  [L0805]
D16  LED-GREEN-0805  [L0805]
D17  LED-GREEN-0805  [L0805]
D18  LED-GREEN-0805  [L0805]
R27  R-1K5-0805  [R0805]
R28  R-1K5-0805  [R0805]
R29  R-1K5-0805  [R0805]
R30  R-1K5-0805  [R0805]
R31  R-1K-0805  [R0805]
R32  R-1K5-0805  [R0805]
R33  R-1K5-0805  [R0805]
R34  R-1K5-0805  [R0805]
R35  R-5K2-0805  [R0805]
U7  MAX-22199  [21-0140_T3255+6_MXM]

### Nets
+3V3: C40.1 C41.1 U7.16(VL) U7.28(M0) U7.29(M1) U7.31(VDD) ; also sheet 2,3,4,5,6,7,9,10,11
GND [GND]: C40.2 C41.2 D11.C D12.C D13.C D14.C D15.C D16.C D17.C D18.C R35.1 U7.25(GND_2) U7.26(I.C.) U7.32(GND) U7.33(EP) ; also sheet 1,2,3,4,5,6,7,9,10,11
IN_!FAULT!: U7.14(!FAULT) ; also sheet 3
IN_!LATCH!: U7.12(!LATCH) ; also sheet 3
IN_!READY!: U7.15(!READY) ; also sheet 3
INPUT1: R27.1 ; also sheet 1
INPUT1_LED: D11.A U7.2(LED1)
INPUT2: R28.1 ; also sheet 1
INPUT2_LED: D13.A U7.4(LED2)
INPUT3: R29.1 ; also sheet 1
INPUT3_LED: D15.A U7.6(LED3)
INPUT4: R30.1 ; also sheet 1
INPUT4_LED: D17.A U7.8(LED4)
INPUT5: R31.1 ; also sheet 1
INPUT5_LED: D12.A U7.17(LED5)
INPUT6: R32.1 ; also sheet 1
INPUT6_LED: D14.A U7.19(LED6)
INPUT7: R33.1 ; also sheet 1
INPUT7_LED: D16.A U7.21(LED7)
INPUT8: R34.1 ; also sheet 1
INPUT8_LED: D18.A U7.23(LED8)
N$1: R35.2 U7.27(REFDI)
N$21: R27.2 U7.1(IN1)
N$22: R28.2 U7.3(IN2)
N$23: R29.2 U7.5(IN3)
N$24: R30.2 U7.7(IN4)
N$25: R31.2 U7.18(IN5)
N$26: R32.2 U7.20(IN6)
N$27: R33.2 U7.22(IN7)
N$28: R34.2 U7.24(IN8)
SPI2_!CS!_INP1: U7.9(!CS) ; also sheet 3
SPI2_MISO: U7.13(SDO) ; also sheet 3,4,11
SPI2_MOSI: U7.11(SDI) ; also sheet 3,4,9
SPI2_SCK: U7.10(SCLK) ; also sheet 3,4,9,10,11
Unconnected: U7.30(VDD24)

### Notes on the sheet
- Digital Inputs

## Sheet 9 of 11: Outputs 1 - 8
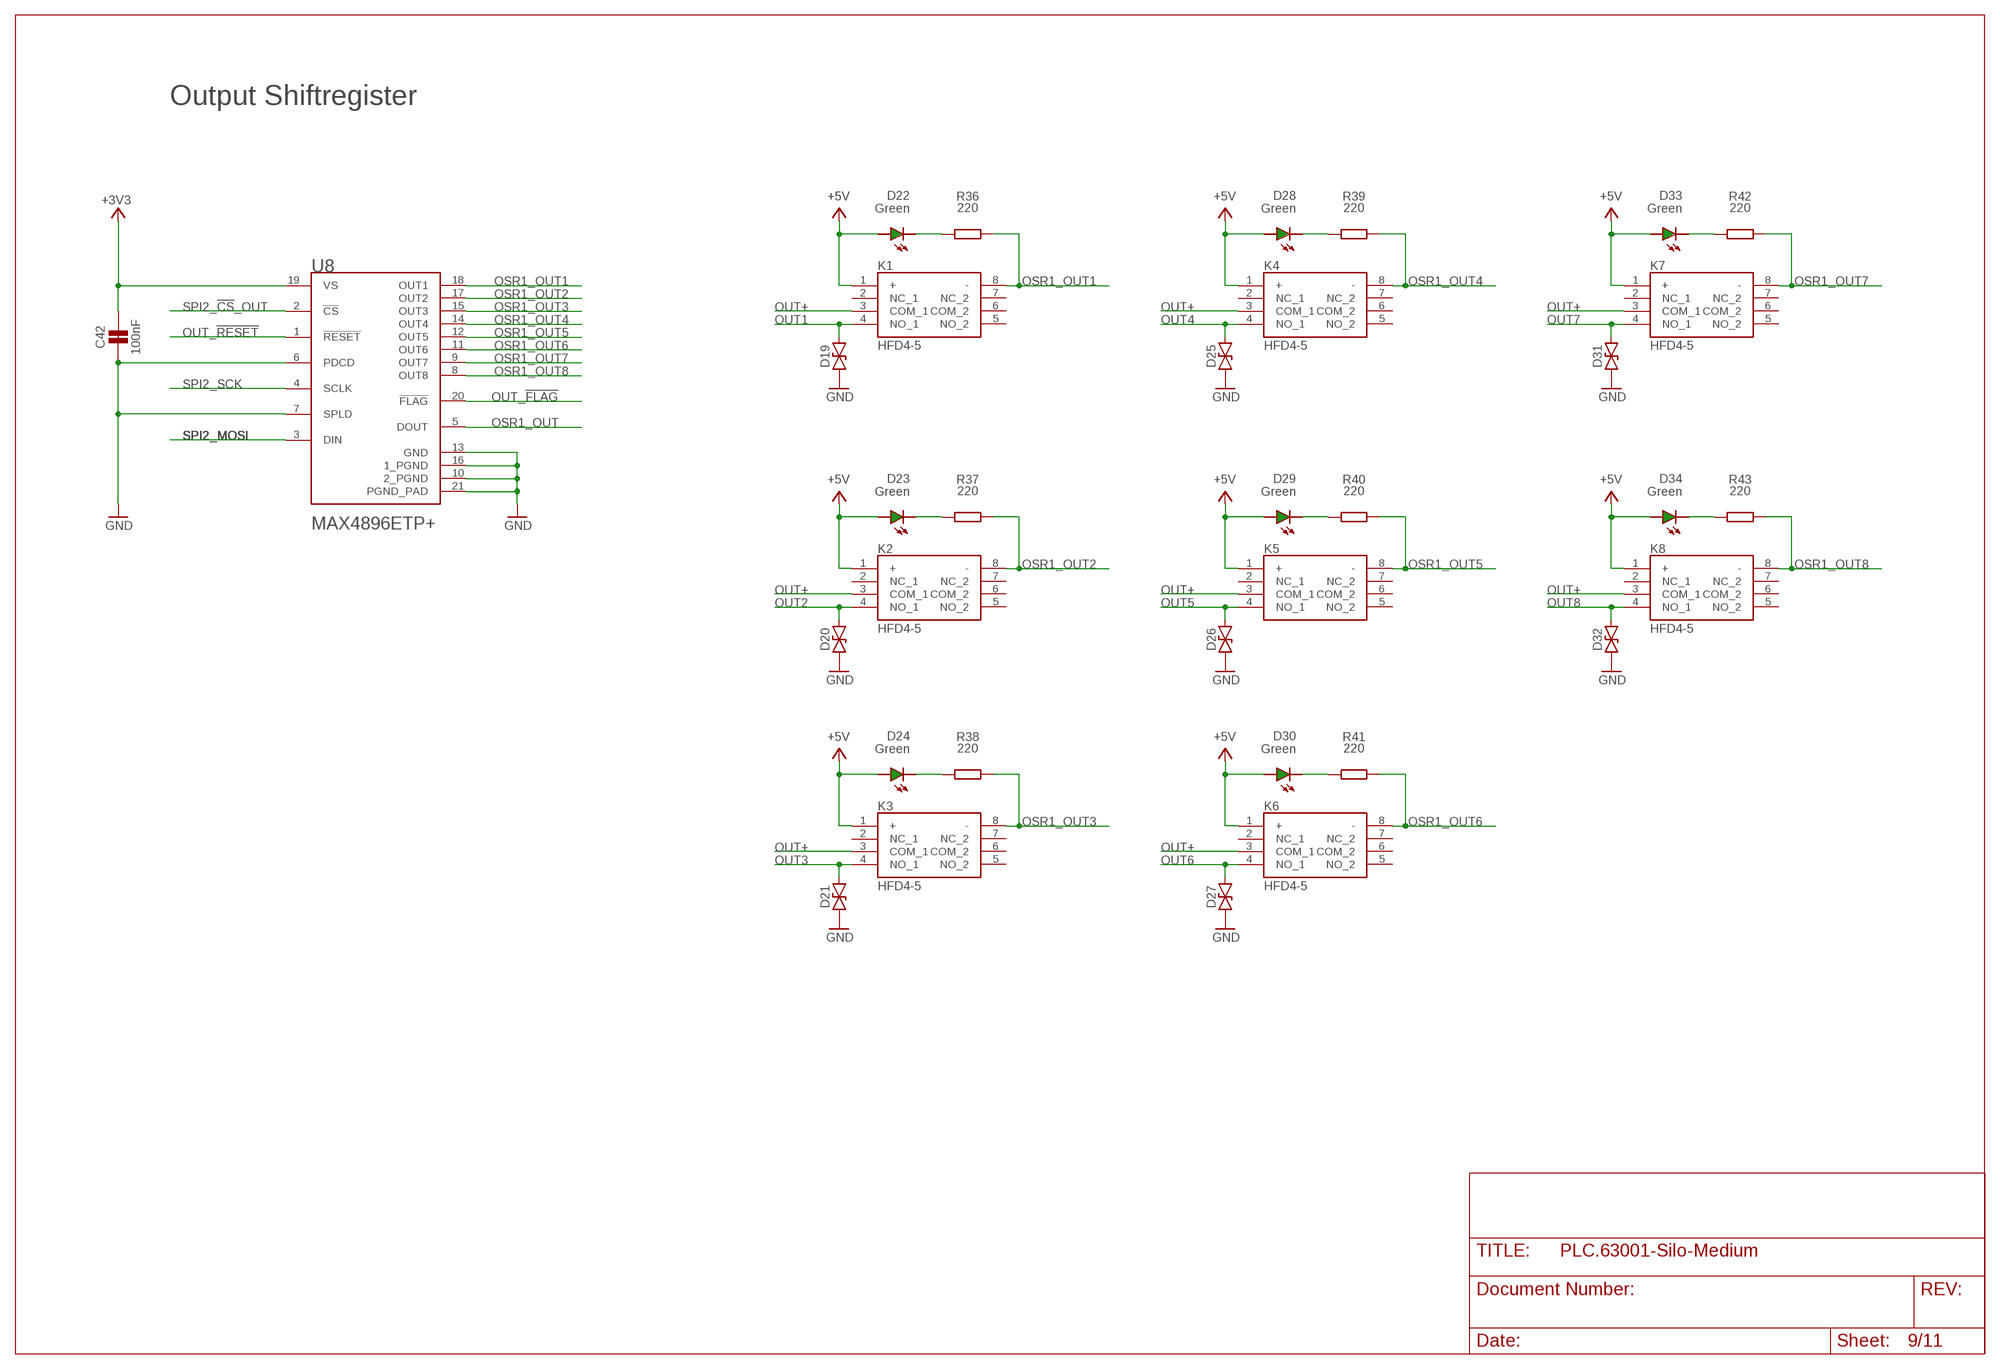
[diagram p8: schematic, sheet 9]

### Parts
C42  C-100N-0805  [C0805]
D19  SMAJ30CA  SMF36CA  [SOD123FL]
D20  SMAJ30CA  SMF36CA  [SOD123FL]
D21  SMAJ30CA  SMF36CA  [SOD123FL]
D22  LED-GREEN-0805  [L0805]
D23  LED-GREEN-0805  [L0805]
D24  LED-GREEN-0805  [L0805]
D25  SMAJ30CA  SMF36CA  [SOD123FL]
D26  SMAJ30CA  SMF36CA  [SOD123FL]
D27  SMAJ30CA  SMF36CA  [SOD123FL]
D28  LED-GREEN-0805  [L0805]
D29  LED-GREEN-0805  [L0805]
D30  LED-GREEN-0805  [L0805]
D31  SMAJ30CA  SMF36CA  [SOD123FL]
D32  SMAJ30CA  SMF36CA  [SOD123FL]
D33  LED-GREEN-0805  [L0805]
D34  LED-GREEN-0805  [L0805]
K1  HFD4-5  [HFD45S]
K2  HFD4-5  [HFD45S]
K3  HFD4-5  [HFD45S]
K4  HFD4-5  [HFD45S]
K5  HFD4-5  [HFD45S]
K6  HFD4-5  [HFD45S]
K7  HFD4-5  [HFD45S]
K8  HFD4-5  [HFD45S]
R36  R-220-0805  [R0805]
R37  R-220-0805  [R0805]
R38  R-220-0805  [R0805]
R39  R-220-0805  [R0805]
R40  R-220-0805  [R0805]
R41  R-220-0805  [R0805]
R42  R-220-0805  [R0805]
R43  R-220-0805  [R0805]
U8  MAX-4896  [QFN65P500X500X80-21N]

### Nets
+3V3: C42.1 U8.19(VS) ; also sheet 2,3,4,5,6,7,8,10,11
+5V: D22.A D23.A D24.A D28.A D29.A D30.A D33.A D34.A K1.1(+) K2.1(+) K3.1(+) K4.1(+) K5.1(+) K6.1(+) K7.1(+) K8.1(+) ; also sheet 2,10,11
GND [GND]: C42.2 D19.A D20.A D21.A D25.A D26.A D27.A D31.A D32.A U8.6(PDCD) U8.7(SPLD) U8.10(2_PGND) U8.13(GND) U8.16(1_PGND) U8.21(PGND_PAD) ; also sheet 1,2,3,4,5,6,7,8,10,11
N$5: D23.C R37.1
N$11: D28.C R39.1
N$12: D33.C R42.1
N$14: D29.C R40.1
N$15: D34.C R43.1
N$16: D24.C R38.1
N$17: D30.C R41.1
N$39: D22.C R36.1
OSR1_OUT: U8.5(DOUT) ; also sheet 10
OSR1_OUT1: K1.8(-) R36.2 U8.18(OUT1)
OSR1_OUT2: K2.8(-) R37.2 U8.17(OUT2)
OSR1_OUT3: K3.8(-) R38.2 U8.15(OUT3)
OSR1_OUT4: K4.8(-) R39.2 U8.14(OUT4)
OSR1_OUT5: K5.8(-) R40.2 U8.12(OUT5)
OSR1_OUT6: K6.8(-) R41.2 U8.11(OUT6)
OSR1_OUT7: K7.8(-) R42.2 U8.9(OUT7)
OSR1_OUT8: K8.8(-) R43.2 U8.8(OUT8)
OUT1: D19.C K1.4(NO_1) ; also sheet 1
OUT2 [24V]: D20.C K2.4(NO_1) ; also sheet 1
OUT3: D21.C K3.4(NO_1) ; also sheet 1
OUT4: D25.C K4.4(NO_1) ; also sheet 1
OUT5: D26.C K5.4(NO_1) ; also sheet 1
OUT6: D27.C K6.4(NO_1) ; also sheet 1
OUT7: D31.C K7.4(NO_1) ; also sheet 1
OUT8: D32.C K8.4(NO_1) ; also sheet 1
OUT+ [24V]: K1.3(COM_1) K2.3(COM_1) K3.3(COM_1) K4.3(COM_1) K5.3(COM_1) K6.3(COM_1) K7.3(COM_1) K8.3(COM_1) ; also sheet 1,10,11
OUT_!FLAG!: U8.20(!FLAG!) ; also sheet 3,10,11
OUT_!RESET!: U8.1(!RESET!) ; also sheet 3,10,11
SPI2_!CS!_OUT: U8.2(!CS!) ; also sheet 3,10,11
SPI2_MOSI: U8.3(DIN) ; also sheet 3,4,8
SPI2_SCK: U8.4(SCLK) ; also sheet 3,4,8,10,11
Unconnected: K1.2(NC_1) K1.5(NO_2) K1.6(COM_2) K1.7(NC_2) K2.2(NC_1) K2.5(NO_2) K2.6(COM_2) K2.7(NC_2) K3.2(NC_1) K3.5(NO_2) K3.6(COM_2) K3.7(NC_2) K4.2(NC_1) K4.5(NO_2) K4.6(COM_2) K4.7(NC_2) K5.2(NC_1) K5.5(NO_2) K5.6(COM_2) K5.7(NC_2) K6.2(NC_1) K6.5(NO_2) K6.6(COM_2) K6.7(NC_2) K7.2(NC_1) K7.5(NO_2) K7.6(COM_2) K7.7(NC_2) K8.2(NC_1) K8.5(NO_2) K8.6(COM_2) K8.7(NC_2)

### Notes on the sheet
- Output Shiftregister

## Sheet 10 of 11: Outputs 9 - 16
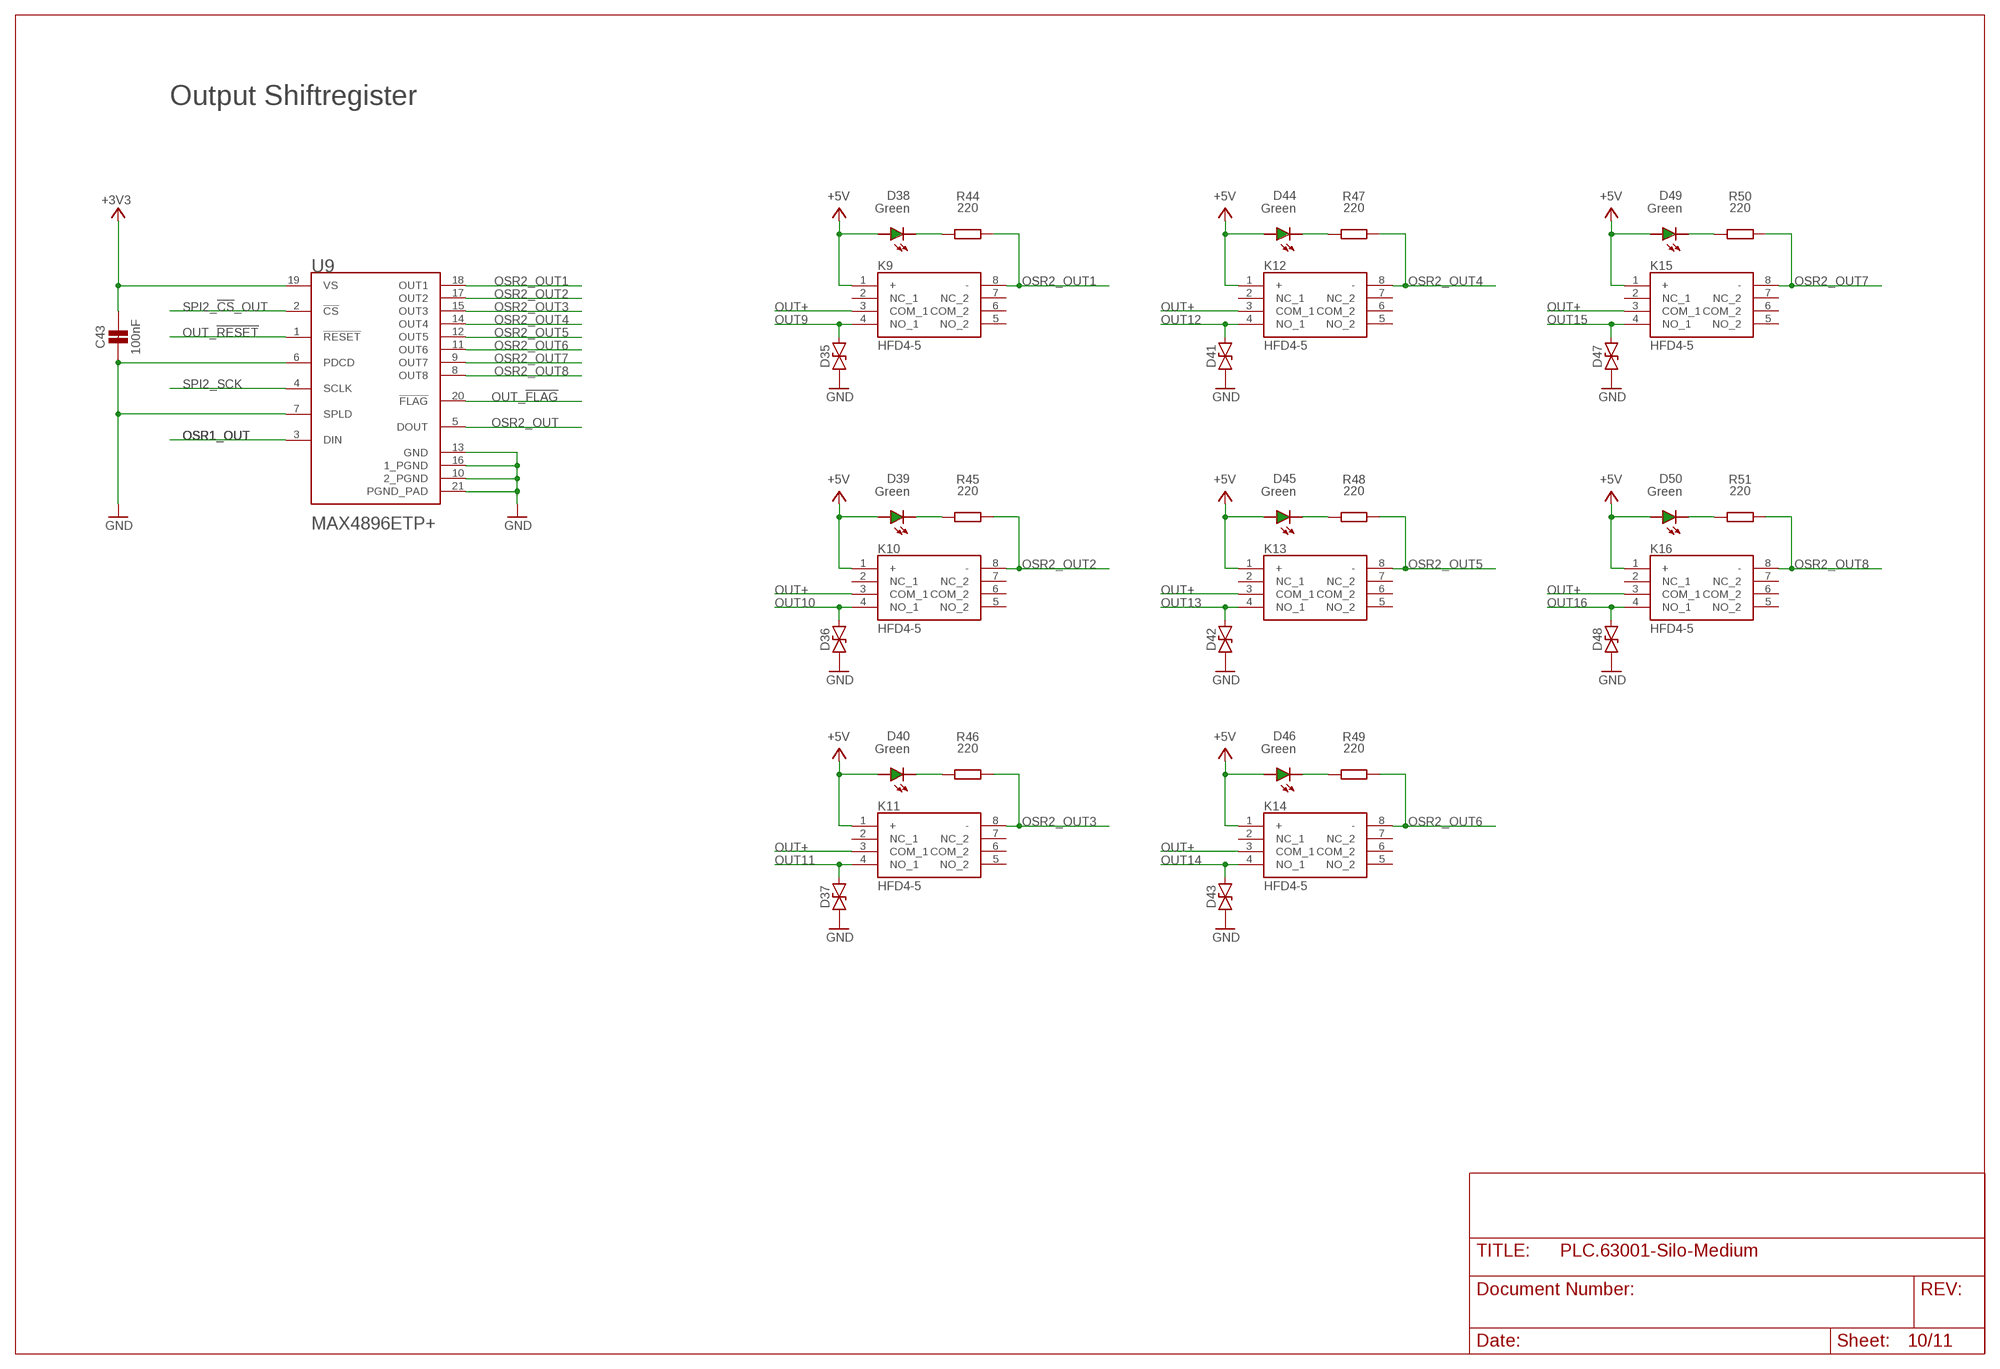
[diagram p9: schematic, sheet 10]

### Parts
C43  C-100N-0805  [C0805]
D35  SMAJ30CA  SMF36CA  [SOD123FL]
D36  SMAJ30CA  SMF36CA  [SOD123FL]
D37  SMAJ30CA  SMF36CA  [SOD123FL]
D38  LED-GREEN-0805  [L0805]
D39  LED-GREEN-0805  [L0805]
D40  LED-GREEN-0805  [L0805]
D41  SMAJ30CA  SMF36CA  [SOD123FL]
D42  SMAJ30CA  SMF36CA  [SOD123FL]
D43  SMAJ30CA  SMF36CA  [SOD123FL]
D44  LED-GREEN-0805  [L0805]
D45  LED-GREEN-0805  [L0805]
D46  LED-GREEN-0805  [L0805]
D47  SMAJ30CA  SMF36CA  [SOD123FL]
D48  SMAJ30CA  SMF36CA  [SOD123FL]
D49  LED-GREEN-0805  [L0805]
D50  LED-GREEN-0805  [L0805]
K9  HFD4-5  [HFD45S]
K10  HFD4-5  [HFD45S]
K11  HFD4-5  [HFD45S]
K12  HFD4-5  [HFD45S]
K13  HFD4-5  [HFD45S]
K14  HFD4-5  [HFD45S]
K15  HFD4-5  [HFD45S]
K16  HFD4-5  [HFD45S]
R44  R-220-0805  [R0805]
R45  R-220-0805  [R0805]
R46  R-220-0805  [R0805]
R47  R-220-0805  [R0805]
R48  R-220-0805  [R0805]
R49  R-220-0805  [R0805]
R50  R-220-0805  [R0805]
R51  R-220-0805  [R0805]
U9  MAX-4896  [QFN65P500X500X80-21N]

### Nets
+3V3: C43.1 U9.19(VS) ; also sheet 2,3,4,5,6,7,8,9,11
+5V: D38.A D39.A D40.A D44.A D45.A D46.A D49.A D50.A K9.1(+) K10.1(+) K11.1(+) K12.1(+) K13.1(+) K14.1(+) K15.1(+) K16.1(+) ; also sheet 2,9,11
GND [GND]: C43.2 D35.A D36.A D37.A D41.A D42.A D43.A D47.A D48.A U9.6(PDCD) U9.7(SPLD) U9.10(2_PGND) U9.13(GND) U9.16(1_PGND) U9.21(PGND_PAD) ; also sheet 1,2,3,4,5,6,7,8,9,11
N$30: D38.C R44.1
N$31: D44.C R47.1
N$32: D49.C R50.1
N$34: D45.C R48.1
N$35: D50.C R51.1
N$36: D40.C R46.1
N$37: D46.C R49.1
N$38: D39.C R45.1
OSR1_OUT: U9.3(DIN) ; also sheet 9
OSR2_OUT: U9.5(DOUT) ; also sheet 11
OSR2_OUT1: K9.8(-) R44.2 U9.18(OUT1)
OSR2_OUT2: K10.8(-) R45.2 U9.17(OUT2)
OSR2_OUT3: K11.8(-) R46.2 U9.15(OUT3)
OSR2_OUT4: K12.8(-) R47.2 U9.14(OUT4)
OSR2_OUT5: K13.8(-) R48.2 U9.12(OUT5)
OSR2_OUT6: K14.8(-) R49.2 U9.11(OUT6)
OSR2_OUT7: K15.8(-) R50.2 U9.9(OUT7)
OSR2_OUT8: K16.8(-) R51.2 U9.8(OUT8)
OUT9 [24V]: D35.C K9.4(NO_1) ; also sheet 1
OUT10 [24V]: D36.C K10.4(NO_1) ; also sheet 1
OUT11: D37.C K11.4(NO_1) ; also sheet 1
OUT12: D41.C K12.4(NO_1) ; also sheet 1
OUT13 [24V]: D42.C K13.4(NO_1) ; also sheet 1
OUT14 [24V]: D43.C K14.4(NO_1) ; also sheet 1
OUT15 [24V]: D47.C K15.4(NO_1) ; also sheet 1
OUT16 [24V]: D48.C K16.4(NO_1) ; also sheet 1
OUT+ [24V]: K9.3(COM_1) K10.3(COM_1) K11.3(COM_1) K12.3(COM_1) K13.3(COM_1) K14.3(COM_1) K15.3(COM_1) K16.3(COM_1) ; also sheet 1,9,11
OUT_!FLAG!: U9.20(!FLAG!) ; also sheet 3,9,11
OUT_!RESET!: U9.1(!RESET!) ; also sheet 3,9,11
SPI2_!CS!_OUT: U9.2(!CS!) ; also sheet 3,9,11
SPI2_SCK: U9.4(SCLK) ; also sheet 3,4,8,9,11
Unconnected: K9.2(NC_1) K9.5(NO_2) K9.6(COM_2) K9.7(NC_2) K10.2(NC_1) K10.5(NO_2) K10.6(COM_2) K10.7(NC_2) K11.2(NC_1) K11.5(NO_2) K11.6(COM_2) K11.7(NC_2) K12.2(NC_1) K12.5(NO_2) K12.6(COM_2) K12.7(NC_2) K13.2(NC_1) K13.5(NO_2) K13.6(COM_2) K13.7(NC_2) K14.2(NC_1) K14.5(NO_2) K14.6(COM_2) K14.7(NC_2) K15.2(NC_1) K15.5(NO_2) K15.6(COM_2) K15.7(NC_2) K16.2(NC_1) K16.5(NO_2) K16.6(COM_2) K16.7(NC_2)

### Notes on the sheet
- Output Shiftregister

## Sheet 11 of 11: Outputs 17-24
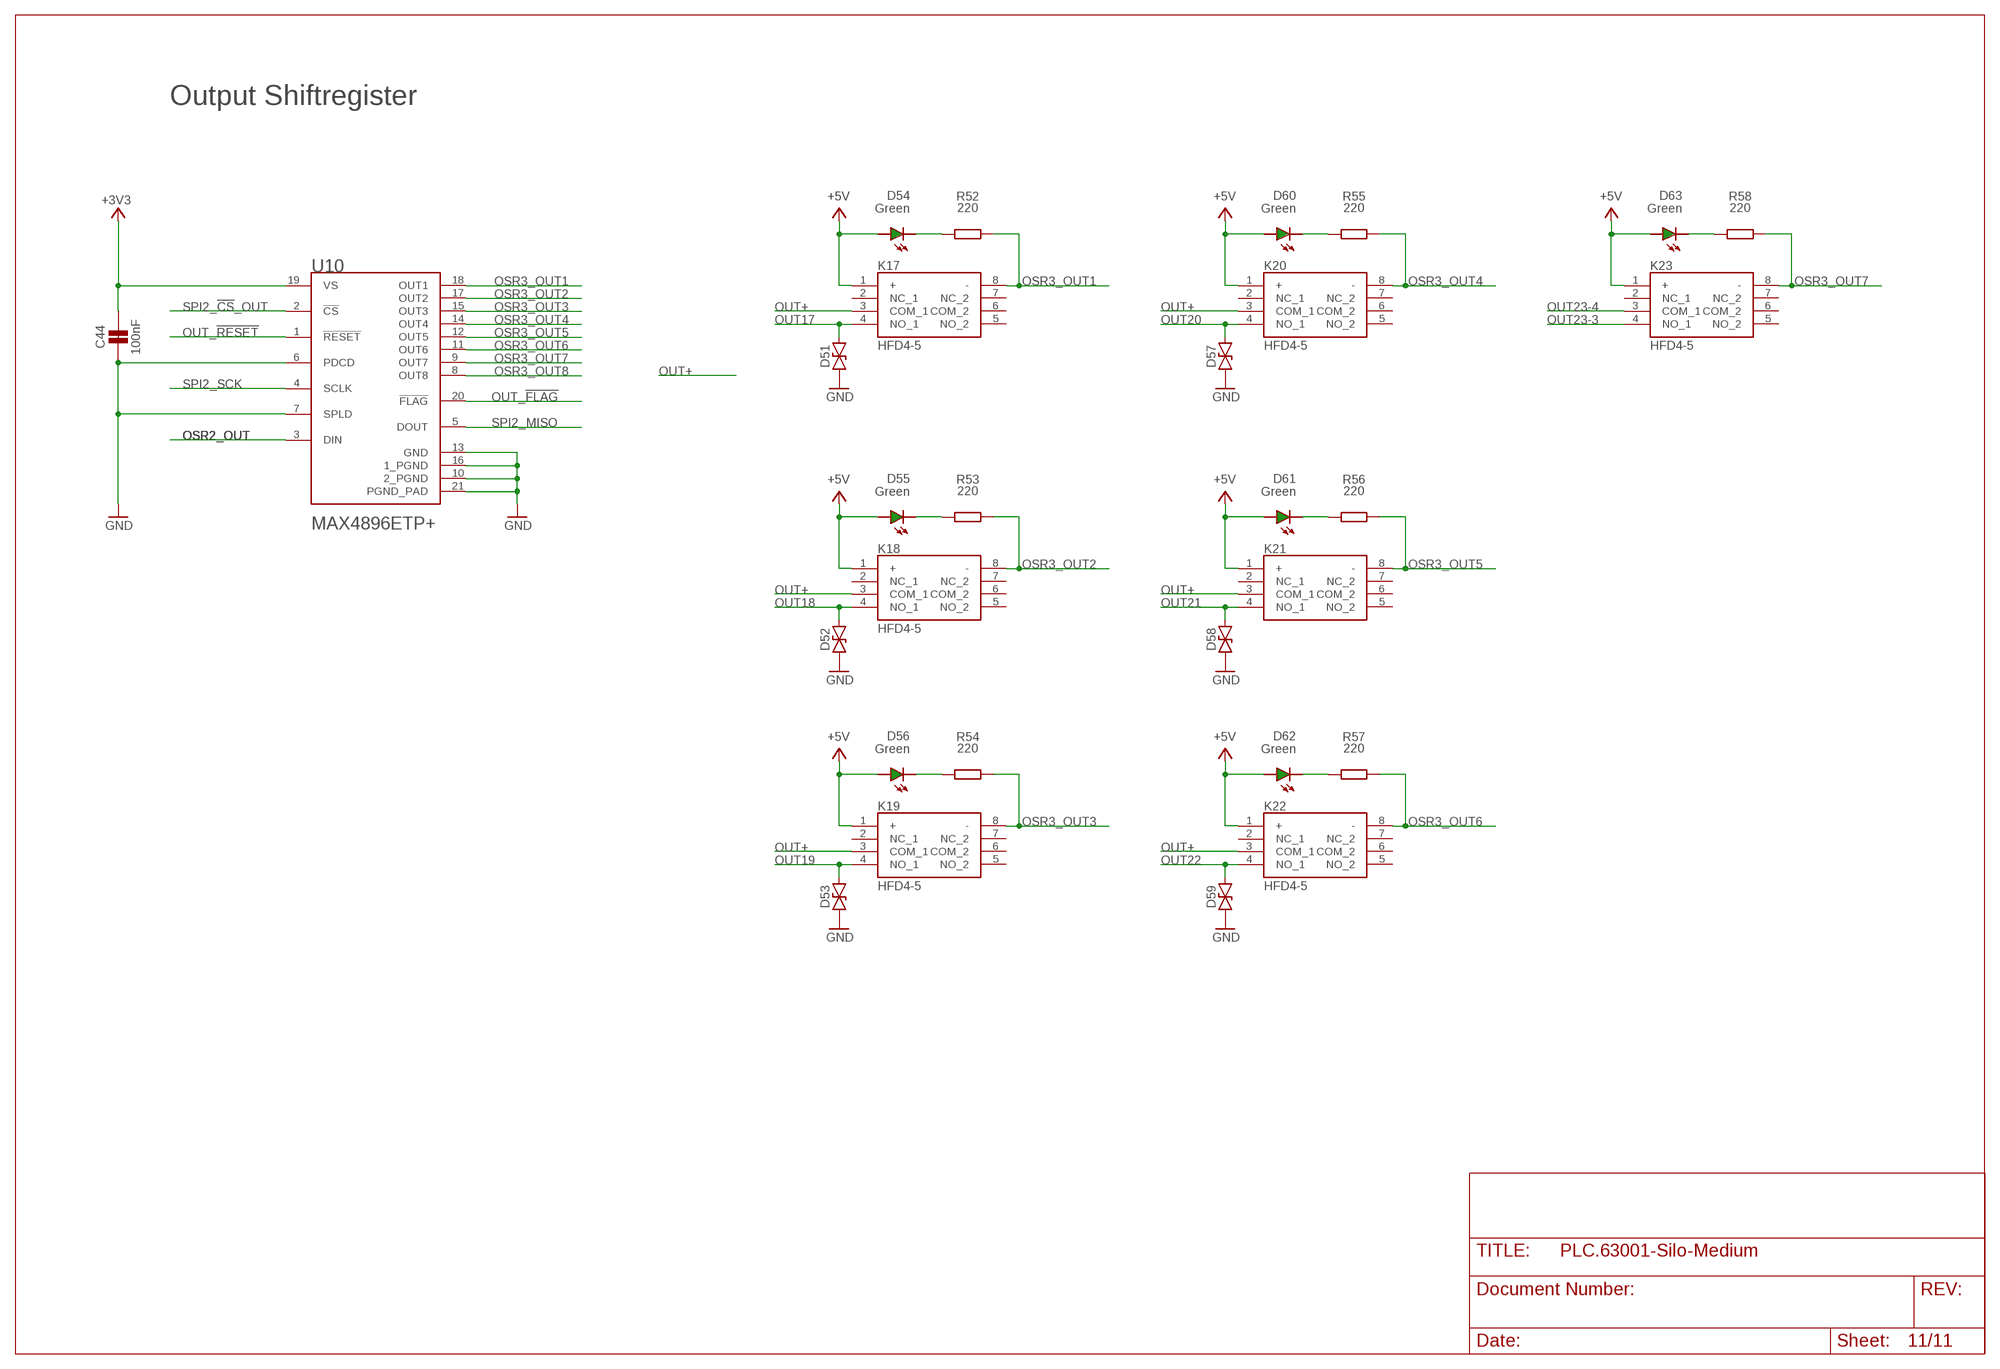
[diagram p10: schematic, sheet 11]

### Parts
C44  C-100N-0805  [C0805]
D51  SMAJ30CA  SMF36CA  [SOD123FL]
D52  SMAJ30CA  SMF36CA  [SOD123FL]
D53  SMAJ30CA  SMF36CA  [SOD123FL]
D54  LED-GREEN-0805  [L0805]
D55  LED-GREEN-0805  [L0805]
D56  LED-GREEN-0805  [L0805]
D57  SMAJ30CA  SMF36CA  [SOD123FL]
D58  SMAJ30CA  SMF36CA  [SOD123FL]
D59  SMAJ30CA  SMF36CA  [SOD123FL]
D60  LED-GREEN-0805  [L0805]
D61  LED-GREEN-0805  [L0805]
D62  LED-GREEN-0805  [L0805]
D63  LED-GREEN-0805  [L0805]
K17  HFD4-5  [HFD45S]
K18  HFD4-5  [HFD45S]
K19  HFD4-5  [HFD45S]
K20  HFD4-5  [HFD45S]
K21  HFD4-5  [HFD45S]
K22  HFD4-5  [HFD45S]
K23  HFD4-5  [HFD45S]
R52  R-220-0805  [R0805]
R53  R-220-0805  [R0805]
R54  R-220-0805  [R0805]
R55  R-220-0805  [R0805]
R56  R-220-0805  [R0805]
R57  R-220-0805  [R0805]
R58  R-220-0805  [R0805]
U10  MAX-4896  [QFN65P500X500X80-21N]

### Nets
+3V3: C44.1 U10.19(VS) ; also sheet 2,3,4,5,6,7,8,9,10
+5V: D54.A D55.A D56.A D60.A D61.A D62.A D63.A K17.1(+) K18.1(+) K19.1(+) K20.1(+) K21.1(+) K22.1(+) K23.1(+) ; also sheet 2,9,10
GND [GND]: C44.2 D51.A D52.A D53.A D57.A D58.A D59.A U10.6(PDCD) U10.7(SPLD) U10.10(2_PGND) U10.13(GND) U10.16(1_PGND) U10.21(PGND_PAD) ; also sheet 1,2,3,4,5,6,7,8,9,10
N$3: D54.C R52.1
N$4: D60.C R55.1
N$6: D63.C R58.1
N$7: D61.C R56.1
N$13: D56.C R54.1
N$18: D62.C R57.1
N$20: D55.C R53.1
OSR2_OUT: U10.3(DIN) ; also sheet 10
OSR3_OUT1: K17.8(-) R52.2 U10.18(OUT1)
OSR3_OUT2: K18.8(-) R53.2 U10.17(OUT2)
OSR3_OUT3: K19.8(-) R54.2 U10.15(OUT3)
OSR3_OUT4: K20.8(-) R55.2 U10.14(OUT4)
OSR3_OUT5: K21.8(-) R56.2 U10.12(OUT5)
OSR3_OUT6: K22.8(-) R57.2 U10.11(OUT6)
OSR3_OUT7: K23.8(-) R58.2 U10.9(OUT7)
OSR3_OUT8: U10.8(OUT8)
OUT17 [24V]: D51.C K17.4(NO_1) ; also sheet 1
OUT18 [24V]: D52.C K18.4(NO_1) ; also sheet 1
OUT19 [24V]: D53.C K19.4(NO_1) ; also sheet 1
OUT20 [24V]: D57.C K20.4(NO_1) ; also sheet 1
OUT21 [24V]: D58.C K21.4(NO_1) ; also sheet 1
OUT22 [24V]: D59.C K22.4(NO_1) ; also sheet 1
OUT23-3 [24V]: K23.4(NO_1) ; also sheet 1
OUT23-4 [24V]: K23.3(COM_1) ; also sheet 1
OUT+ [24V]: K17.3(COM_1) K18.3(COM_1) K19.3(COM_1) K20.3(COM_1) K21.3(COM_1) K22.3(COM_1) ; also sheet 1,9,10
OUT_!FLAG!: U10.20(!FLAG!) ; also sheet 3,9,10
OUT_!RESET!: U10.1(!RESET!) ; also sheet 3,9,10
SPI2_!CS!_OUT: U10.2(!CS!) ; also sheet 3,9,10
SPI2_MISO: U10.5(DOUT) ; also sheet 3,4,8
SPI2_SCK: U10.4(SCLK) ; also sheet 3,4,8,9,10
Unconnected: K17.2(NC_1) K17.5(NO_2) K17.6(COM_2) K17.7(NC_2) K18.2(NC_1) K18.5(NO_2) K18.6(COM_2) K18.7(NC_2) K19.2(NC_1) K19.5(NO_2) K19.6(COM_2) K19.7(NC_2) K20.2(NC_1) K20.5(NO_2) K20.6(COM_2) K20.7(NC_2) K21.2(NC_1) K21.5(NO_2) K21.6(COM_2) K21.7(NC_2) K22.2(NC_1) K22.5(NO_2) K22.6(COM_2) K22.7(NC_2) K23.2(NC_1) K23.5(NO_2) K23.6(COM_2) K23.7(NC_2)

### Notes on the sheet
- Output Shiftregister

## Library data of the parts
C1 C7 C9 = Softtec_SMD:C-220U-10X10: Elektrolyt Kondenstator 220 µF - 50VDC SMD 10x10 Capacitor lytic SMD WT Series 50V 220uF Source: Datasheet <https://datasheet.octopart.com/UWT1H221MNL1GS-Nichicon-datasheet-12520520.pdf>; VAL: 220uF
C2 C8 C18 C24 C26 C27 C29 C31-C33 C41 = Softtec_SMD:C-1U-0805: Keramikkondensator 1 µF - 50VDC SMD 0805 50V 100nF X7R ±10% 0805 Multilayer Ceramic Capacitors MLCC - SMD/SMT ROHS Source: Datasheet; VAL: 1uF
C3-C6 C11-C13 C15 C16 C37 C39 C40 C42-C44 = Softtec_SMD:C-100N-0805: Keramikkondensator 0.1 µF - 50VDC SMD 0805 50V 100nF X7R ±10% 0805 Multilayer Ceramic Capacitors MLCC - SMD/SMT ROHS Source: Datasheet <https://docs.rs-online.com/601e/0900766b81110dfe.pdf>; VAL: 100nF
C10 C14 C25 C28 = Softtec_SMD:C-18P-0805: Keramikkondensator 18 pF - 50VDC SMD 0805 50V 18 pF X7R ±10% 0805 Multilayer Ceramic Capacitors MLCC - SMD/SMT ROHS Source: Datasheet; VAL: 18pF
C17 C34 C35 = Softtec_SMD:C-10U-0805: Keramikkondensator 10 µF - 50VDC SMD 0805 50V 10 µF X7R ±10% 0805 Multilayer Ceramic Capacitors MLCC - SMD/SMT ROHS Source: Datasheet; VAL: 10uF
C19 = Softtec_SMD:C-1N-1812: Keramikkondensator 1 nF - 2kV SMD 1812 2kV 1nF X7R ±10% 1812 Multilayer Ceramic Capacitors MLCC - SMD/SMT ROHS Source: Datasheet; VAL: 1nF
C20 = Softtec_SMD:C-22N-0805: Keramikkondensator 22 nF - 50VDC SMD 0805 50V 22nF X7R ±10% 0805 Multilayer Ceramic Capacitors MLCC - SMD/SMT ROHS Source: Datasheet; VAL: 22nF
C21 C30 = Softtec_SMD:C-10N-0805: Keramikkondensator 10 nF - 50VDC SMD 0805 50V 10nF X7R ±10% 0805 Multilayer Ceramic Capacitors MLCC - SMD/SMT ROHS Source: Datasheet; VAL: 10nF
C22 C23 = Softtec_SMD:C-68N-0805: Keramikkondensator 68 nF - 50VDC SMD 0805 50V 68nF X7R ±10% 0805 Multilayer Ceramic Capacitors MLCC - SMD/SMT ROHS Source: Datasheet; VAL: 68nF
C36 C38 = Softtec_SMD:C-4U7-0805: Keramikkondensator 4.7 µF - 50VDC SMD 0805 50V 4.7 µF X7R ±10% 0805 Multilayer Ceramic Capacitors MLCC - SMD/SMT ROHS Source: Datasheet; VAL: 4.7uF
D1 D2 D12 D14 D16-D18 D22-D24 D28-D30 D33 D34 D38-D40 D44-D46 D49 D50 D54-D56 D60-D63 = Softtec_SMD:LED-GREEN-0805: LED Grün 3,1V SMD 0805 5mA 360mcd 3.1V Yellow -40℃~+85℃ Green light 120° 100mW 0805 Light Emitting Diodes (LED) ROHS Source: Datasheet <https://datasheet.lcsc.com/lcsc/1912111437_Yongyu-Photoelectric-SZYY0805G_C434432.pdf>; VAL: Green
D3 = Softtec_SMD:LED-BLUE-0805: LED Blau 3,1V SMD 0805 5mA 100mcd 3.1V 469nm Colorless transparence -40℃~+85℃ 460nm~475nm blue 120° 100mW 0805 Light Emitting Diodes (LED) ROHS Source: Datasheet <https://datasheet.lcsc.com/lcsc/1912111437_Yongyu-Photoelectric-SZYY0805B_C434433.pdf>; VAL: Blue
D4 D11 D13 D15 = Softtec_SMD:LED-RED-0805: LED Rot 2,4V SMD 0805 10mA 120mcd 2.4V 645nm Colorless transparence -40℃~+85℃ 615nm~630nm Red 120° 40mW 0805 Light Emitting Diodes (LED) ROHS Source: Datasheet <https://datasheet.lcsc.com/lcsc/1912111437_Yongyu-Photoelectric-SZYY0805R_C434431.pdf>; VAL: Red
D5-D10 = Softtec_SMD:SMAJ30CA: ESD Suppressors / TVS Diodes 400W 30V 5% Bi-Direct
D19-D21 D25-D27 D31 D32 D35-D37 D41-D43 D47 D48 D51-D53 D57-D59 = Softtec_SMD:SMF36CA: ESD Suppressors / TVS Diodes 400W 30V 5% Bi-Direct
F1 F2 = Softtec_SMD:F-1500MA: Resettable Fuses - PPTC Fuse Source: Datasheet; DESCRIPTION: Resettable Fuses - PPTC Fuse; HEIGHT: 0.75mm; MANUFACTURER_NAME: Stewart Connector; MANUFACTURER_PART_NUMBER: 0ZCG0050AF2C; VAL: 1500mA
F3 F4 = Softtec_SMD:04401.25WR: Surface Mount Fuses 63V High I2T 1206 1.25A Source: Datasheet; DESCRIPTION: Surface Mount Fuses 63V High I2T 1206 1.25A; HEIGHT: 0.864mm; MANUFACTURER_NAME: LITTELFUSE; MANUFACTURER_PART_NUMBER: 04401.25WR; MOUSER_PART_NUMBER: 576-04401.25WR; MOUSER_PRICE-STOCK: https://www.mouser.co.uk/ProductDetail/Littelfuse/0440125WR?qs=fp%2Fo%2FcJ74omAgBzJeaHnPg%3D%3D
FB1 = Softtec_SMD:FB-120R: Ferrite Bead 120R - 3000mA max.; MANUFACTURER: Murata; PACKAGEREFERENCE: 0805; VAL: 120R/3000mA
J1 = Softtec_SMD:OMN_5_06: Weidmüller Omnimate 4.0 Connector - 5.0 mm - 6 Pins; MANUFACTURER_PART_NUMBER: 8000072438; MFR_NAME: Weidmuller
J2 J3 J9 = Softtec_SMD:OMN_5_08: Weidmüller Omnimate 4.0 Connector - 5.0 mm - 8 Pins
J4 J6 J7 = Softtec_SMD:OMN_5_05: Weidmüller Omnimate 4.0 Connector - 5.0 mm - 5 Pins
J5 = Softtec_SMD:OMN_5_12: Weidmüller Omnimate 4.0 Connector - 5.0 mm - 12 Pins; COPYRIGHT: Copyright (C) 2022 Ultra Librarian. All rights reserved.; MANUFACTURER_PART_NUMBER: 8000072470; MFR_NAME: Weidmuller
J8 = Softtec_SMD:OMN_5_12: Weidmüller Omnimate 4.0 Connector - 5.0 mm - 12 Pins
J10 = Softtec_SMD:SWD-CON-10: Serial Wire (SW-DP) Connector Standard 0.05" 10-pin connector is for use with the Cortex M and Cortex A SWD (serial wire debugger) interface (SW-DP) Connectors 2x05_1.27MM_SMT - Inexpensive surface-mount header with bare pins, compatible with standard 10-pin SWD cables (4UCON: 16846) 2x05_1.27MM_BOX_NOPOSTS - Polarised surface-mount box (4UCON with caps: 19735, without caps: 15117 2x05_1.27MM_BOX_POSTS - Polarised surface-mount box with mounting holes (4UCON: 20317) Pinout: http://infocenter.arm.com/help/topic/com.arm.doc.faqs/attached/13634/cortex_debug_connectors.pdf http://www.keil.com/peripherals/coresight/connectors.asp
J11 = Softtec_SMD:NET-MAG-LED_THR_180
J12 = Softtec_SMD:NET-THR_180: Einbaubuchse RJ45 180° 8 polig THR; MANUFACTURER_PART_NUMBER: 2562970000; MFR_NAME: Weidmuller
K1-K23 = Softtec_SMD:HFD4-5: Relais (Print) 5V DC - 2 Wechsler SMD 10x7,5 DPDT 5V@DC 2A 220V@ Max 250V@Max Nolocking SMD Signal Relays ROHS Source: Datasheet <https://datasheet.octopart.com/HFD4/5-SR-Hongfa-datasheet-12509947.pdf>; DESCRIPTION: 5 Volt Coil, DPDT Contacts, Fuly Sealed,; HEIGHT: 5mm; MANUFACTURER_NAME: Hongfa; MANUFACTURER_PART_NUMBER: HFD4/5-S
L1 = Softtec_SMD:ID-100UH: Power inductor SMD shielded 100uH Bourns SRR1280 Series Shielded Wire-wound SMD Inductor with a Ferrite Core, 100 uH +/-20% 2.1A Idc Q:18 Source: Datasheet <https://componentsearchengine.com/Datasheets/2/SRR1280-101M.pdf>; DESCRIPTION: Power inductor SMD shielded 100uH Bourns SRR1280 Series Shielded Wire-wound SMD Inductor with a Ferrite Core, 100 uH +/-20% 2.1A Idc Q:18; HEIGHT: 10mm; MANUFACTURER_PART_NUMBER: SRR1210-101M
N1-N3 = Softtec_SMD:_FIDUCIAL: Standard Fiducial 1mm
PS1 = Softtec_SMD:TSR1-2450SM: 1 Amp POL switching regulator, 3.0 to -36 VDC input, pos.-pos. circuit, SMD package Source: Datasheet <https://tracopower.com/tsr1sm-datasheet/>; DESCRIPTION: 1 Amp POL switching regulator, 3.0 to -36 VDC input, pos.-pos. circuit, SMD package; HEIGHT: 7.6mm; MANUFACTURER_NAME: Traco Power; MANUFACTURER_PART_NUMBER: TSR 1-2450SM
R1 R2 R36-R58 = Softtec_SMD:R-220-0805: Widerstand 220Ω 0,125W SMD 0805; VAL: 220
R3 R4 R26 = Softtec_SMD:R-4K7-0805: Widerstand 4,7kΩ 0,125W SMD 0805; VAL: 4.7k
R5 R7 R20-R24 R59 R60 = Softtec_SMD:R-10K-0805: Widerstand 10kΩ 0,125W SMD 0805; VAL: 10k
R6 = Softtec_SMD:R-390-0805: Widerstand 390Ω 0,125W SMD 0805; VAL: 390
R8 R9 = Softtec_SMD:R-120-0805: Widerstand 120Ω 0,125W SMD 0805; VAL: 120
R10 R11 = Softtec_SMD:R-2K2-0805: Widerstand 2k2Ω 0,125W SMD 0805; VAL: 2k2
R12 = Softtec_SMD:R-10-0805: Widerstand 10Ω 0,125W SMD 0805; VAL: 10
R13 R15 R17 R18 = Softtec_SMD:R-49R9-0805: Widerstand 49,9Ω 0,125W SMD 0805; VAL: 49,9
R14 R16 = Softtec_SMD:R-33-0805: Widerstand 33Ω 0,125W SMD 0805; VAL: 33
R19 = Softtec_SMD:R-1M-0805: Widerstand 1MΩ 0,125W SMD 0805; VAL: 1M
R25 = Softtec_SMD:R-12K4-0805: Widerstand 12,4 kΩ 0,125W SMD 0805; VAL: 12k4
R27-R30 R32-R34 = Softtec_SMD:R-1K5-0805: Widerstand 1k5Ω 0,125W SMD 0805; VAL: 1k5
R31 = Softtec_SMD:R-1K-0805: Widerstand 1kΩ 0,125W SMD 0805; VAL: 1k
R35 = Softtec_SMD:R-5K2-0805: Widerstand 5,2kΩ 0,125W SMD 0805; VAL: 5.2k
S1 = Softtec_SMD:SWT-10P: Rotary Switch SMD 10 Positions 7,4 x 7,4
U1 = Softtec_SMD:BASEBOARD_TOOLING
U2 = Softtec_SMD:LDO-5V-3V3: LDO 5V > 3V3 - 500 mA
U3 = Softtec_SMD:STM32F103RB: Medium-density performance line ARM®-based 32-bit MCU with 64 or 128 KB Flash, USB, CAN, 7 timers, 2 ADCs, 9 com. interfaces; DATASHEET: http://www.st.com/content/ccc/resource/technical/document/datasheet/33/d4/6f/1d/df/0b/4c/6d/CD00161566.pdf/files/CD00161566.pdf/jcr:content/translations/en.CD00161566.pdf; DIGIKEY_DESCRIPTION: IC MCU 32BIT 128KB FLASH 64LQFP; MF: ST Microelectronics; MPN: STM32F103RBT6; PACKAGE: LQFP-64
U4 = Softtec_SMD:W5500: WIZNet W5500 Ethernet Chipset; COMPONENT_LINK_1_DESCRIPTION: Manufacturer URL; DATASHEET: http://wizwiki.net/wiki/lib/exe/fetch.php?media=products:w5500:w5500_ds_v106e_141230.pdf; MF: WIZnet; MPN: W5500; PACKAGE: LQFP-48; PACKAGE_DESCRIPTION: 48-Pin Low-profile Quad Flat Package, Body 7.00 x 7.00 mm, Pitch 0.50 mm
U5 = Softtec_SMD:MAX-3486: MAX3486 RS422/485 Transceiver RS-422/RS-485 Interface IC 3.3V Powered, 10Mbps and Slew-Rate Limited, True RS-485/RS-422 Transceivers Source: Datasheet <https://datasheets.maximintegrated.com/en/ds/MAX3483-MAX3491.pdf>; DESCRIPTION: RS-422/RS-485 Interface IC 3.3V Powered, 10Mbps and Slew-Rate Limited, True RS-485/RS-422 Transceivers; HEIGHT: 1.75mm; MANUFACTURER_NAME: Maxim Integrated; MANUFACTURER_PART_NUMBER: MAX3486CSA+T
U6 = Softtec_SMD:DS18B20Z: Programmable Resolution 1-Wire Digital Thermometer; MANUFACTURER_PART_NUMBER: DS18B20Z+; MFR_NAME: Maxim Integrated Products
U7 = Softtec_SMD:MAX-22199: MAX22199 8 Kanal Eingangsstreiber + ShiftReg MAX22199 - Industrial Digital Inputdriver 8 Channel, TQFN-EP-32 Source: Datasheet <https://datasheets.maximintegrated.com/en/ds/MAX22199.pdf>; COPYRIGHT: Copyright (C) 2022 Ultra Librarian. All rights reserved.; MANUFACTURER_PART_NUMBER: MAX22199ATJ+; MFR_NAME: Maxim Integrated Products
U8-U10 = Softtec_SMD:MAX-4896: MAX4896 8 Kanal Ausgangstreiber + ShiftReg MAX4896 - Relay/Load Driver, 8 Outputs, 2.7V to 5.5V Supply, 200mA Out, TQFN-EP-20 Source: Datasheet <https://datasheets.maximintegrated.com/en/ds/MAX4896.pdf>; DESCRIPTION: MAXIM INTEGRATED PRODUCTS - MAX4896ETP+T - Relay/Load Driver, 8 Outputs, 2.7V to 5.5V Supply, 200mA Out, TQFN-EP-20; HEIGHT: 0.8mm; MANUFACTURER_NAME: Maxim Integrated; MANUFACTURER_PART_NUMBER: MAX4896ETP+T
U11 = Softtec_SMD:M95256-RMC6TG: 256 Kbit SPI bus EEPROM with high-speed clock Source: Datasheet <https://www.st.com/resource/en/datasheet/m95256-w.pdf>; DESCRIPTION: 256 Kbit SPI bus EEPROM with high-speed clock; HEIGHT: 0.6mm; MANUFACTURER_NAME: STMicroelectronics; MANUFACTURER_PART_NUMBER: M95256-RMC6TG; MOUSER_PART_NUMBER: 511-M95256-RMC6TG; MOUSER_PRICE-STOCK: https://www.mouser.co.uk/ProductDetail/STMicroelectronics/M95256-RMC6TG?qs=aA7MvVR8Lz9LotHHhIKeGQ%3D%3D
X19-X25 = Softtec_SMD:_NC_MARKER
Y1 = Softtec_SMD:QRZ-8MHZ: Quarze 8MHz, 20 pF, 3225, TOL +/-20, STAB +/-50 ppm, -40 +85 C, 400O; VAL: 8MHz
Y2 = Softtec_SMD:QRZ-25MHZ: Crystals ESR 50,FREQ 25,STABILITY +/-30ppm,TOLERANCE +/-10ppm,CL 18pF,AGING +/-2 ppm ,-30 C 85 C,100uW in typical (Max 200uW), 2.50mm x 2.00mm Source: Datasheet <https://www.mouser.in/datasheet/2/122/ECX_2236B2-2400583.pdf>; MANUFACTURER_PART_NUMBER: ECS-250-18-36B2-CTY-TR; VAL: 25MHz

## Net classes
0 default: width 0.2 mm, clearance 0.15 mm
1 GND: width 0.2 mm, clearance 0.15 mm
4 230V: width 2.5 mm, clearance 1 mm
5 24V: width 1 mm, clearance 0.2 mm